# EAGLE design pcb (EAGLE 9.6.2)
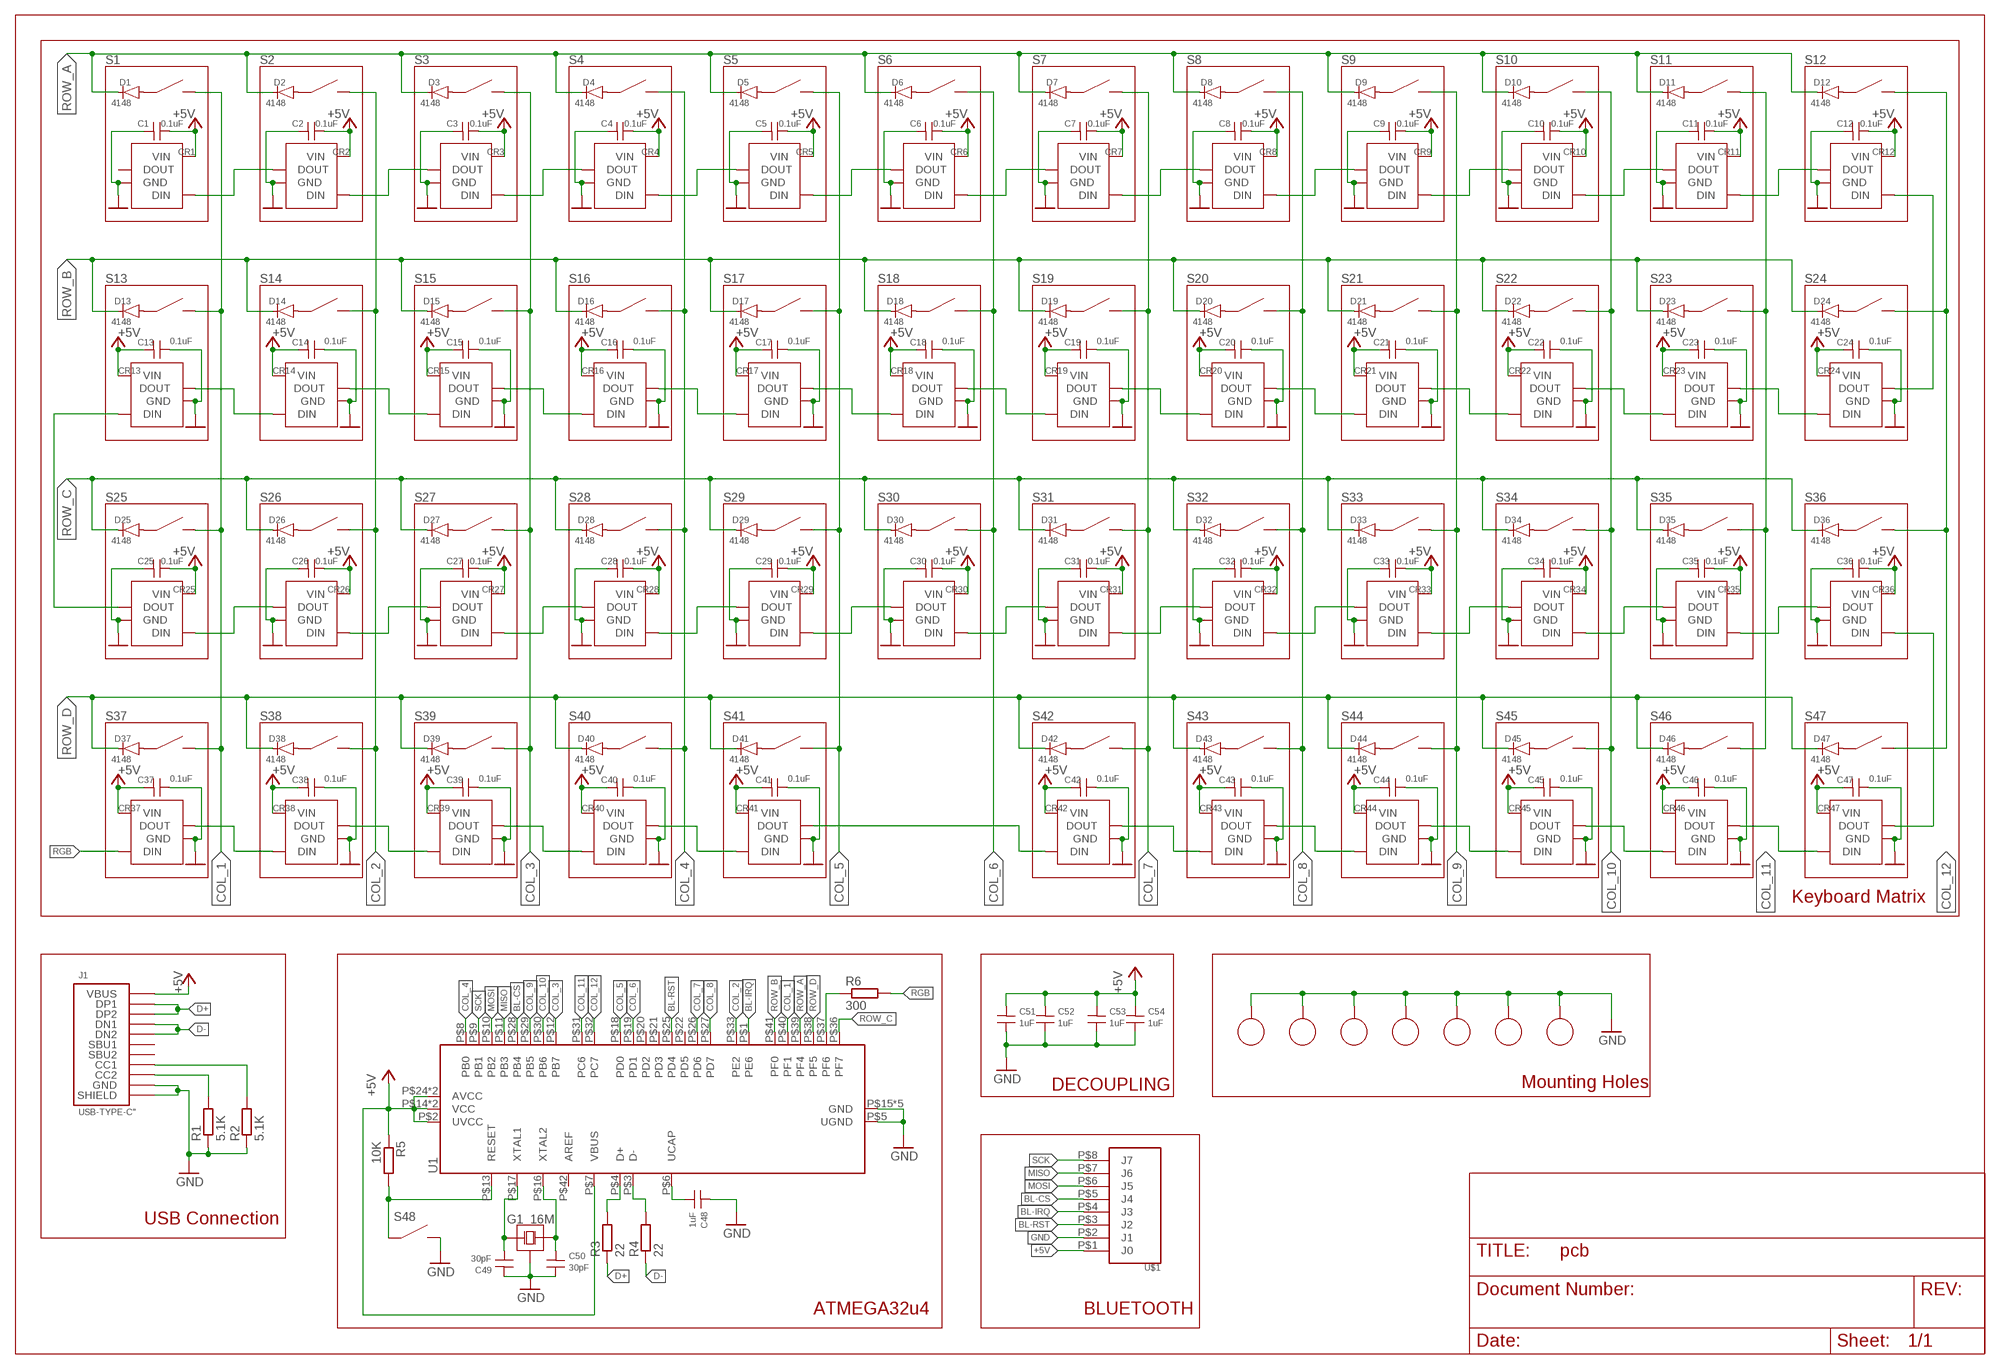
[diagram p0: schematic, sheet 1]

## Parts
C1  0.1uF  C-EU-0.1U-0402  [C0402]
C2  0.1uF  C-EU-0.1U-0402  [C0402]
C3  0.1uF  C-EU-0.1U-0402  [C0402]
C4  0.1uF  C-EU-0.1U-0402  [C0402]
C5  0.1uF  C-EU-0.1U-0402  [C0402]
C6  0.1uF  C-EU-0.1U-0402  [C0402]
C7  0.1uF  C-EU-0.1U-0402  [C0402]
C8  0.1uF  C-EU-0.1U-0402  [C0402]
C9  0.1uF  C-EU-0.1U-0402  [C0402]
C10  0.1uF  C-EU-0.1U-0402  [C0402]
C11  0.1uF  C-EU-0.1U-0402  [C0402]
C12  0.1uF  C-EU-0.1U-0402  [C0402]
C13  0.1uF  C-EU-0.1U-0402  [C0402]
C14  0.1uF  C-EU-0.1U-0402  [C0402]
C15  0.1uF  C-EU-0.1U-0402  [C0402]
C16  0.1uF  C-EU-0.1U-0402  [C0402]
C17  0.1uF  C-EU-0.1U-0402  [C0402]
C18  0.1uF  C-EU-0.1U-0402  [C0402]
C19  0.1uF  C-EU-0.1U-0402  [C0402]
C20  0.1uF  C-EU-0.1U-0402  [C0402]
C21  0.1uF  C-EU-0.1U-0402  [C0402]
C22  0.1uF  C-EU-0.1U-0402  [C0402]
C23  0.1uF  C-EU-0.1U-0402  [C0402]
C24  0.1uF  C-EU-0.1U-0402  [C0402]
C25  0.1uF  C-EU-0.1U-0402  [C0402]
C26  0.1uF  C-EU-0.1U-0402  [C0402]
C27  0.1uF  C-EU-0.1U-0402  [C0402]
C28  0.1uF  C-EU-0.1U-0402  [C0402]
C29  0.1uF  C-EU-0.1U-0402  [C0402]
C30  0.1uF  C-EU-0.1U-0402  [C0402]
C31  0.1uF  C-EU-0.1U-0402  [C0402]
C32  0.1uF  C-EU-0.1U-0402  [C0402]
C33  0.1uF  C-EU-0.1U-0402  [C0402]
C34  0.1uF  C-EU-0.1U-0402  [C0402]
C35  0.1uF  C-EU-0.1U-0402  [C0402]
C36  0.1uF  C-EU-0.1U-0402  [C0402]
C37  0.1uF  C-EU-0.1U-0402  [C0402]
C38  0.1uF  C-EU-0.1U-0402  [C0402]
C39  0.1uF  C-EU-0.1U-0402  [C0402]
C40  0.1uF  C-EU-0.1U-0402  [C0402]
C41  0.1uF  C-EU-0.1U-0402  [C0402]
C42  0.1uF  C-EU-0.1U-0402  [C0402]
C43  0.1uF  C-EU-0.1U-0402  [C0402]
C44  0.1uF  C-EU-0.1U-0402  [C0402]
C45  0.1uF  C-EU-0.1U-0402  [C0402]
C46  0.1uF  C-EU-0.1U-0402  [C0402]
C47  0.1uF  C-EU-0.1U-0402  [C0402]
C48  1uF  C-EU-1U-0402  [C0402]
C49  30pF  C-EU-30P-0402  [C0402]
C50  30pF  C-EU-30P-0402  [C0402]
C51  1uF  C-EU-1U-0402  [C0402]
C52  1uF  C-EU-1U-0402  [C0402]
C53  1uF  C-EU-1U-0402  [C0402]
C54  1uF  C-EU-1U-0402  [C0402]
CR1  SK6812MINI-E  [SK6812MINI-E]
CR2  SK6812MINI-E  [SK6812MINI-E]
CR3  SK6812MINI-E  [SK6812MINI-E]
CR4  SK6812MINI-E  [SK6812MINI-E]
CR5  SK6812MINI-E  [SK6812MINI-E]
CR6  SK6812MINI-E  [SK6812MINI-E]
CR7  SK6812MINI-E  [SK6812MINI-E]
CR8  SK6812MINI-E  [SK6812MINI-E]
CR9  SK6812MINI-E  [SK6812MINI-E]
CR10  SK6812MINI-E  [SK6812MINI-E]
CR11  SK6812MINI-E  [SK6812MINI-E]
CR12  SK6812MINI-E  [SK6812MINI-E]
CR13  SK6812MINI-E  [SK6812MINI-E]
CR14  SK6812MINI-E  [SK6812MINI-E]
CR15  SK6812MINI-E  [SK6812MINI-E]
CR16  SK6812MINI-E  [SK6812MINI-E]
CR17  SK6812MINI-E  [SK6812MINI-E]
CR18  SK6812MINI-E  [SK6812MINI-E]
CR19  SK6812MINI-E  [SK6812MINI-E]
CR20  SK6812MINI-E  [SK6812MINI-E]
CR21  SK6812MINI-E  [SK6812MINI-E]
CR22  SK6812MINI-E  [SK6812MINI-E]
CR23  SK6812MINI-E  [SK6812MINI-E]
CR24  SK6812MINI-E  [SK6812MINI-E]
CR25  SK6812MINI-E  [SK6812MINI-E]
CR26  SK6812MINI-E  [SK6812MINI-E]
CR27  SK6812MINI-E  [SK6812MINI-E]
CR28  SK6812MINI-E  [SK6812MINI-E]
CR29  SK6812MINI-E  [SK6812MINI-E]
CR30  SK6812MINI-E  [SK6812MINI-E]
CR31  SK6812MINI-E  [SK6812MINI-E]
CR32  SK6812MINI-E  [SK6812MINI-E]
CR33  SK6812MINI-E  [SK6812MINI-E]
CR34  SK6812MINI-E  [SK6812MINI-E]
CR35  SK6812MINI-E  [SK6812MINI-E]
CR36  SK6812MINI-E  [SK6812MINI-E]
CR37  SK6812MINI-E  [SK6812MINI-E]
CR38  SK6812MINI-E  [SK6812MINI-E]
CR39  SK6812MINI-E  [SK6812MINI-E]
CR40  SK6812MINI-E  [SK6812MINI-E]
CR41  SK6812MINI-E  [SK6812MINI-E]
CR42  SK6812MINI-E  [SK6812MINI-E]
CR43  SK6812MINI-E  [SK6812MINI-E]
CR44  SK6812MINI-E  [SK6812MINI-E]
CR45  SK6812MINI-E  [SK6812MINI-E]
CR46  SK6812MINI-E  [SK6812MINI-E]
CR47  SK6812MINI-E  [SK6812MINI-E]
D1  4148  DIODE-4148-MINI-MELF  [MINI_MELF]
D2  4148  DIODE-4148-MINI-MELF  [MINI_MELF]
D3  4148  DIODE-4148-MINI-MELF  [MINI_MELF]
D4  4148  DIODE-4148-MINI-MELF  [MINI_MELF]
D5  4148  DIODE-4148-MINI-MELF  [MINI_MELF]
D6  4148  DIODE-4148-MINI-MELF  [MINI_MELF]
D7  4148  DIODE-4148-MINI-MELF  [MINI_MELF]
D8  4148  DIODE-4148-MINI-MELF  [MINI_MELF]
D9  4148  DIODE-4148-MINI-MELF  [MINI_MELF]
D10  4148  DIODE-4148-MINI-MELF  [MINI_MELF]
D11  4148  DIODE-4148-MINI-MELF  [MINI_MELF]
D12  4148  DIODE-4148-MINI-MELF  [MINI_MELF]
D13  4148  DIODE-4148-MINI-MELF  [MINI_MELF]
D14  4148  DIODE-4148-MINI-MELF  [MINI_MELF]
D15  4148  DIODE-4148-MINI-MELF  [MINI_MELF]
D16  4148  DIODE-4148-MINI-MELF  [MINI_MELF]
D17  4148  DIODE-4148-MINI-MELF  [MINI_MELF]
D18  4148  DIODE-4148-MINI-MELF  [MINI_MELF]
D19  4148  DIODE-4148-MINI-MELF  [MINI_MELF]
D20  4148  DIODE-4148-MINI-MELF  [MINI_MELF]
D21  4148  DIODE-4148-MINI-MELF  [MINI_MELF]
D22  4148  DIODE-4148-MINI-MELF  [MINI_MELF]
D23  4148  DIODE-4148-MINI-MELF  [MINI_MELF]
D24  4148  DIODE-4148-MINI-MELF  [MINI_MELF]
D25  4148  DIODE-4148-MINI-MELF  [MINI_MELF]
D26  4148  DIODE-4148-MINI-MELF  [MINI_MELF]
D27  4148  DIODE-4148-MINI-MELF  [MINI_MELF]
D28  4148  DIODE-4148-MINI-MELF  [MINI_MELF]
D29  4148  DIODE-4148-MINI-MELF  [MINI_MELF]
D30  4148  DIODE-4148-MINI-MELF  [MINI_MELF]
D31  4148  DIODE-4148-MINI-MELF  [MINI_MELF]
D32  4148  DIODE-4148-MINI-MELF  [MINI_MELF]
D33  4148  DIODE-4148-MINI-MELF  [MINI_MELF]
D34  4148  DIODE-4148-MINI-MELF  [MINI_MELF]
D35  4148  DIODE-4148-MINI-MELF  [MINI_MELF]
D36  4148  DIODE-4148-MINI-MELF  [MINI_MELF]
D37  4148  DIODE-4148-MINI-MELF  [MINI_MELF]
D38  4148  DIODE-4148-MINI-MELF  [MINI_MELF]
D39  4148  DIODE-4148-MINI-MELF  [MINI_MELF]
D40  4148  DIODE-4148-MINI-MELF  [MINI_MELF]
D41  4148  DIODE-4148-MINI-MELF  [MINI_MELF]
D42  4148  DIODE-4148-MINI-MELF  [MINI_MELF]
D43  4148  DIODE-4148-MINI-MELF  [MINI_MELF]
D44  4148  DIODE-4148-MINI-MELF  [MINI_MELF]
D45  4148  DIODE-4148-MINI-MELF  [MINI_MELF]
D46  4148  DIODE-4148-MINI-MELF  [MINI_MELF]
D47  4148  DIODE-4148-MINI-MELF  [MINI_MELF]
G1  16M  CRYSTAL-PKG-16MSMD3225-4P  [SMD3225-4P]
J1  USB-TYPE-C"  [USB-C-SMD_TYPE-C16PIN]
R1  5.1K  R-EU-5.1K-0402  [R0402]
R2  5.1K  R-EU-5.1K-0402  [R0402]
R3  22  R-EU-22-0402  [R0402]
R4  22  R-EU-22-0402  [R0402]
R5  10K  R-EU-10K-0402  [R0402]
R6  300  R-EU-300-0402  [R0402]
S1  MX_SWITCH  [MX_SWITCH]
S2  MX_SWITCH  [MX_SWITCH]
S3  MX_SWITCH  [MX_SWITCH]
S4  MX_SWITCH  [MX_SWITCH]
S5  MX_SWITCH  [MX_SWITCH]
S6  MX_SWITCH  [MX_SWITCH]
S7  MX_SWITCH  [MX_SWITCH]
S8  MX_SWITCH  [MX_SWITCH]
S9  MX_SWITCH  [MX_SWITCH]
S10  MX_SWITCH  [MX_SWITCH]
S11  MX_SWITCH  [MX_SWITCH]
S12  MX_SWITCH  [MX_SWITCH]
S13  MX_SWITCH  [MX_SWITCH]
S14  MX_SWITCH  [MX_SWITCH]
S15  MX_SWITCH  [MX_SWITCH]
S16  MX_SWITCH  [MX_SWITCH]
S17  MX_SWITCH  [MX_SWITCH]
S18  MX_SWITCH  [MX_SWITCH]
S19  MX_SWITCH  [MX_SWITCH]
S20  MX_SWITCH  [MX_SWITCH]
S21  MX_SWITCH  [MX_SWITCH]
S22  MX_SWITCH  [MX_SWITCH]
S23  MX_SWITCH  [MX_SWITCH]
S24  MX_SWITCH  [MX_SWITCH]
S25  MX_SWITCH  [MX_SWITCH]
S26  MX_SWITCH  [MX_SWITCH]
S27  MX_SWITCH  [MX_SWITCH]
S28  MX_SWITCH  [MX_SWITCH]
S29  MX_SWITCH  [MX_SWITCH]
S30  MX_SWITCH  [MX_SWITCH]
S31  MX_SWITCH  [MX_SWITCH]
S32  MX_SWITCH  [MX_SWITCH]
S33  MX_SWITCH  [MX_SWITCH]
S34  MX_SWITCH  [MX_SWITCH]
S35  MX_SWITCH  [MX_SWITCH]
S36  MX_SWITCH  [MX_SWITCH]
S37  MX_SWITCH  [MX_SWITCH]
S38  MX_SWITCH  [MX_SWITCH]
S39  MX_SWITCH  [MX_SWITCH]
S40  MX_SWITCH  [MX_SWITCH]
S41  MX_SWITCH  [MX_SWITCH]
S42  MX_SWITCH  [MX_SWITCH]
S43  MX_SWITCH  [MX_SWITCH]
S44  MX_SWITCH  [MX_SWITCH]
S45  MX_SWITCH  [MX_SWITCH]
S46  MX_SWITCH  [MX_SWITCH]
S47  MX_SWITCH  [MX_SWITCH]
S48  SWITCH-SMD,3*4  [SMD,3X4X2.0MM]
U1  ATMEGA32U4-MUR  [QFN-44_7X7X05P]
U2  M2.5-HOLE  [M2.5]
U3  M2.5-HOLE  [M2.5]
U4  M2.5-HOLE  [M2.5]
U5  M2.5-HOLE  [M2.5]
U6  M2.5-HOLE  [M2.5]
U7  M2.5-HOLE  [M2.5]
U8  M2.5-HOLE  [M2.5]
U$1  JST-8PIN-SR  [JST-SR-8PIN]

## Nets
+5V: C1.P$2 C2.P$2 C3.P$2 C4.P$2 C5.P$2 C6.P$2 C7.P$2 C8.P$2 C9.P$2 C10.P$2 C11.P$2 C12.P$2 C13.P$1 C14.P$1 C15.P$1 C16.P$1 C17.P$1 C18.P$1 C19.P$1 C20.P$1 C21.P$1 C22.P$1 C23.P$1 C24.P$1 C25.P$2 C26.P$2 C27.P$2 C28.P$2 C29.P$2 C30.P$2 C31.P$2 C32.P$2 C33.P$2 C34.P$2 C35.P$2 C36.P$2 C37.P$1 C38.P$1 C39.P$1 C40.P$1 C41.P$1 C42.P$1 C43.P$1 C44.P$1 C45.P$1 C46.P$1 C47.P$1 C51.P$1 C52.P$1 C53.P$1 C54.P$1 CR1.P$1(VIN) CR2.P$1(VIN) CR3.P$1(VIN) CR4.P$1(VIN) CR5.P$1(VIN) CR6.P$1(VIN) CR7.P$1(VIN) CR8.P$1(VIN) CR9.P$1(VIN) CR10.P$1(VIN) CR11.P$1(VIN) CR12.P$1(VIN) CR13.P$1(VIN) CR14.P$1(VIN) CR15.P$1(VIN) CR16.P$1(VIN) CR17.P$1(VIN) CR18.P$1(VIN) CR19.P$1(VIN) CR20.P$1(VIN) CR21.P$1(VIN) CR22.P$1(VIN) CR23.P$1(VIN) CR24.P$1(VIN) CR25.P$1(VIN) CR26.P$1(VIN) CR27.P$1(VIN) CR28.P$1(VIN) CR29.P$1(VIN) CR30.P$1(VIN) CR31.P$1(VIN) CR32.P$1(VIN) CR33.P$1(VIN) CR34.P$1(VIN) CR35.P$1(VIN) CR36.P$1(VIN) CR37.P$1(VIN) CR38.P$1(VIN) CR39.P$1(VIN) CR40.P$1(VIN) CR41.P$1(VIN) CR42.P$1(VIN) CR43.P$1(VIN) CR44.P$1(VIN) CR45.P$1(VIN) CR46.P$1(VIN) CR47.P$1(VIN) J1.A4B9(VBUS) J1.B4A9(VBUS) R5.P$1 U1.P$2(UVCC) U1.P$7(VBUS) U1.P$14(VCC) U1.P$24(AVCC) U1.P$34(VCC) U1.P$44(AVCC) U$1.P$1(J0)
BL-CS: U1.P$28(PB4) U$1.P$5(J4)
BL-IRQ: U1.P$1(PE6) U$1.P$4(J3)
BL-RST: U1.P$25(PD4) U$1.P$3(J2)
COL_1: S1.P$2 S13.P$2 S25.P$2 S37.P$2 U1.P$40(PF1)
COL_2: S2.P$2 S14.P$2 S26.P$2 S38.P$2 U1.P$33(PE2)
COL_3: S3.P$2 S15.P$2 S27.P$2 S39.P$2 U1.P$12(PB7)
COL_4: S4.P$2 S16.P$2 S28.P$2 S40.P$2 U1.P$8(PB0)
COL_5: S5.P$2 S17.P$2 S29.P$2 S41.P$2 U1.P$18(PD0)
COL_6: S6.P$2 S18.P$2 S30.P$2 U1.P$19(PD1)
COL_7: S7.P$2 S19.P$2 S31.P$2 S42.P$2 U1.P$26(PD6)
COL_8: S8.P$2 S20.P$2 S32.P$2 S43.P$2 U1.P$27(PD7)
COL_9: S9.P$2 S21.P$2 S33.P$2 S44.P$2 U1.P$29(PB5)
COL_10: S10.P$2 S22.P$2 S34.P$2 S45.P$2 U1.P$30(PB6)
COL_11: S11.P$2 S23.P$2 S35.P$2 S46.P$2 U1.P$31(PC6)
COL_12: S12.P$2 S24.P$2 S36.P$2 S47.P$2 U1.P$32(PC7)
D+: J1.A6(DP1) J1.B6(DP2) R3.P$1
D-: J1.A7(DN1) J1.B7(DN2) R4.P$1
GND: C1.P$1 C2.P$1 C3.P$1 C4.P$1 C5.P$1 C6.P$1 C7.P$1 C8.P$1 C9.P$1 C10.P$1 C11.P$1 C12.P$1 C13.P$2 C14.P$2 C15.P$2 C16.P$2 C17.P$2 C18.P$2 C19.P$2 C20.P$2 C21.P$2 C22.P$2 C23.P$2 C24.P$2 C25.P$1 C26.P$1 C27.P$1 C28.P$1 C29.P$1 C30.P$1 C31.P$1 C32.P$1 C33.P$1 C34.P$1 C35.P$1 C36.P$1 C37.P$2 C38.P$2 C39.P$2 C40.P$2 C41.P$2 C42.P$2 C43.P$2 C44.P$2 C45.P$2 C46.P$2 C47.P$2 C48.P$1 C49.P$1 C50.P$2 C51.P$2 C52.P$2 C53.P$2 C54.P$2 CR1.P$4(GND) CR2.P$4(GND) CR3.P$4(GND) CR4.P$4(GND) CR5.P$4(GND) CR6.P$4(GND) CR7.P$4(GND) CR8.P$4(GND) CR9.P$4(GND) CR10.P$4(GND) CR11.P$4(GND) CR12.P$4(GND) CR13.P$4(GND) CR14.P$4(GND) CR15.P$4(GND) CR16.P$4(GND) CR17.P$4(GND) CR18.P$4(GND) CR19.P$4(GND) CR20.P$4(GND) CR21.P$4(GND) CR22.P$4(GND) CR23.P$4(GND) CR24.P$4(GND) CR25.P$4(GND) CR26.P$4(GND) CR27.P$4(GND) CR28.P$4(GND) CR29.P$4(GND) CR30.P$4(GND) CR31.P$4(GND) CR32.P$4(GND) CR33.P$4(GND) CR34.P$4(GND) CR35.P$4(GND) CR36.P$4(GND) CR37.P$4(GND) CR38.P$4(GND) CR39.P$4(GND) CR40.P$4(GND) CR41.P$4(GND) CR42.P$4(GND) CR43.P$4(GND) CR44.P$4(GND) CR45.P$4(GND) CR46.P$4(GND) CR47.P$4(GND) G1.P$2(P2) G1.P$4(P2) J1.A1B12(GND) J1.B1A12(GND) J1.SHIELD J1.SHIELD1(SHIELD) J1.SHIELD2(SHIELD) J1.SHIELD3(SHIELD) R1.P$1 R2.P$1 S48.P$2 U1.P$5(UGND) U1.P$15(GND) U1.P$23(GND) U1.P$35(GND) U1.P$43(GND) U1.P$45(GND) U2.P$1(P1) U3.P$1(P1) U4.P$1(P1) U5.P$1(P1) U6.P$1(P1) U7.P$1(P1) U8.P$1(P1) U$1.P$2(J1)
MISO: U1.P$11(PB3) U$1.P$7(J6)
MOSI: U1.P$10(PB2) U$1.P$6(J5)
N$1: CR12.P$3(DIN) CR24.P$2(DOUT)
N$2: CR13.P$3(DIN) CR25.P$2(DOUT)
N$3: R3.P$2 U1.P$4(D+)
N$4: J1.B5(CC2) R1.P$2
N$5: D1.P$2(+) S1.P$1
N$6: J1.A5(CC1) R2.P$2
N$7: R4.P$2 U1.P$3(D-)
N$8: R5.P$2 S48.P$1 U1.P$13(RESET)
N$9: CR1.P$3(DIN) CR2.P$2(DOUT)
N$10: D2.P$2(+) S2.P$1
N$11: C48.P$2 U1.P$6(UCAP)
N$12: C49.P$2 G1.P$1(P0) U1.P$17(XTAL1)
N$13: CR2.P$3(DIN) CR3.P$2(DOUT)
N$14: D13.P$2(+) S13.P$1
N$16: R6.P$1 U1.P$37(PF6)
N$17: CR13.P$2(DOUT) CR14.P$3(DIN)
N$18: C50.P$1 G1.P$3(P1) U1.P$16(XTAL2)
N$19: D20.P$2(+) S20.P$1
N$20: D3.P$2(+) S3.P$1
N$23: CR3.P$3(DIN) CR4.P$2(DOUT)
N$27: CR19.P$2(DOUT) CR20.P$3(DIN)
N$28: D14.P$2(+) S14.P$1
N$30: D4.P$2(+) S4.P$1
N$33: CR4.P$3(DIN) CR5.P$2(DOUT)
N$35: CR14.P$2(DOUT) CR15.P$3(DIN)
N$40: D5.P$2(+) S5.P$1
N$43: CR5.P$3(DIN) CR6.P$2(DOUT)
N$46: D15.P$2(+) S15.P$1
N$49: CR15.P$2(DOUT) CR16.P$3(DIN)
N$50: D6.P$2(+) S6.P$1
N$53: CR6.P$3(DIN) CR7.P$2(DOUT)
N$55: D21.P$2(+) S21.P$1
N$59: CR20.P$2(DOUT) CR21.P$3(DIN)
N$60: D7.P$2(+) S7.P$1
N$63: CR7.P$3(DIN) CR8.P$2(DOUT)
N$64: D16.P$2(+) S16.P$1
N$65: CR27.P$3(DIN) CR28.P$2(DOUT)
N$67: CR16.P$2(DOUT) CR17.P$3(DIN)
N$70: D8.P$2(+) S8.P$1
N$73: CR8.P$3(DIN) CR9.P$2(DOUT)
N$78: D17.P$2(+) S17.P$1
N$80: D9.P$2(+) S9.P$1
N$83: CR9.P$3(DIN) CR10.P$2(DOUT)
N$85: CR17.P$2(DOUT) CR18.P$3(DIN)
N$87: D22.P$2(+) S22.P$1
N$90: D10.P$2(+) S10.P$1
N$93: CR10.P$3(DIN) CR11.P$2(DOUT)
N$95: CR21.P$2(DOUT) CR22.P$3(DIN)
N$96: D18.P$2(+) S18.P$1
N$100: D11.P$2(+) S11.P$1
N$103: CR11.P$3(DIN) CR12.P$2(DOUT)
N$110: D12.P$2(+) S12.P$1
N$114: D19.P$2(+) S19.P$1
N$118: CR18.P$2(DOUT) CR19.P$3(DIN)
N$119: D23.P$2(+) S23.P$1
N$123: CR22.P$2(DOUT) CR23.P$3(DIN)
N$129: D24.P$2(+) S24.P$1
N$133: CR23.P$2(DOUT) CR24.P$3(DIN)
N$139: D25.P$2(+) S25.P$1
N$142: CR25.P$3(DIN) CR26.P$2(DOUT)
N$149: D26.P$2(+) S26.P$1
N$152: CR26.P$3(DIN) CR27.P$2(DOUT)
N$159: D27.P$2(+) S27.P$1
N$169: D28.P$2(+) S28.P$1
N$172: CR28.P$3(DIN) CR29.P$2(DOUT)
N$179: D29.P$2(+) S29.P$1
N$182: CR29.P$3(DIN) CR30.P$2(DOUT)
N$189: D30.P$2(+) S30.P$1
N$192: CR30.P$3(DIN) CR31.P$2(DOUT)
N$199: D31.P$2(+) S31.P$1
N$202: CR31.P$3(DIN) CR32.P$2(DOUT)
N$209: D32.P$2(+) S32.P$1
N$212: CR32.P$3(DIN) CR33.P$2(DOUT)
N$219: D33.P$2(+) S33.P$1
N$222: CR33.P$3(DIN) CR34.P$2(DOUT)
N$229: D34.P$2(+) S34.P$1
N$232: CR34.P$3(DIN) CR35.P$2(DOUT)
N$239: D35.P$2(+) S35.P$1
N$242: CR35.P$3(DIN) CR36.P$2(DOUT)
N$249: D36.P$2(+) S36.P$1
N$252: CR36.P$3(DIN) CR47.P$2(DOUT)
N$259: D37.P$2(+) S37.P$1
N$269: D38.P$2(+) S38.P$1
N$273: CR37.P$2(DOUT) CR38.P$3(DIN)
N$279: D39.P$2(+) S39.P$1
N$283: CR38.P$2(DOUT) CR39.P$3(DIN)
N$289: D40.P$2(+) S40.P$1
N$293: CR39.P$2(DOUT) CR40.P$3(DIN)
N$299: D41.P$2(+) S41.P$1
N$303: CR40.P$2(DOUT) CR41.P$3(DIN)
N$309: D42.P$2(+) S42.P$1
N$313: CR41.P$2(DOUT) CR42.P$3(DIN)
N$319: D43.P$2(+) S43.P$1
N$323: CR42.P$2(DOUT) CR43.P$3(DIN)
N$329: D44.P$2(+) S44.P$1
N$333: CR43.P$2(DOUT) CR44.P$3(DIN)
N$339: D45.P$2(+) S45.P$1
N$343: CR44.P$2(DOUT) CR45.P$3(DIN)
N$349: D46.P$2(+) S46.P$1
N$353: CR45.P$2(DOUT) CR46.P$3(DIN)
N$359: D47.P$2(+) S47.P$1
N$363: CR46.P$2(DOUT) CR47.P$3(DIN)
RGB: CR37.P$3(DIN) R6.P$2
ROW_A: D1.P$1(-) D2.P$1(-) D3.P$1(-) D4.P$1(-) D5.P$1(-) D6.P$1(-) D7.P$1(-) D8.P$1(-) D9.P$1(-) D10.P$1(-) D11.P$1(-) D12.P$1(-) U1.P$39(PF4)
ROW_B: D13.P$1(-) D14.P$1(-) D15.P$1(-) D16.P$1(-) D17.P$1(-) D18.P$1(-) D19.P$1(-) D20.P$1(-) D21.P$1(-) D22.P$1(-) D23.P$1(-) D24.P$1(-) U1.P$41(PF0)
ROW_C: D25.P$1(-) D26.P$1(-) D27.P$1(-) D28.P$1(-) D29.P$1(-) D30.P$1(-) D31.P$1(-) D32.P$1(-) D33.P$1(-) D34.P$1(-) D35.P$1(-) D36.P$1(-) U1.P$36(PF7)
ROW_D: D37.P$1(-) D38.P$1(-) D39.P$1(-) D40.P$1(-) D41.P$1(-) D42.P$1(-) D43.P$1(-) D44.P$1(-) D45.P$1(-) D46.P$1(-) D47.P$1(-) U1.P$38(PF5)
SCK: U1.P$9(PB1) U$1.P$8(J7)
Unconnected: CR1.P$2(DOUT) J1.A8(SBU1) J1.B8(SBU2) U1.P$20(PD2) U1.P$21(PD3) U1.P$22(PD5) U1.P$42(AREF)

## Notes on the sheet
- Keyboard Matrix
- DECOUPLING | Mounting Holes
- USB Connection
- ATMEGA32u4 | BLUETOOTH

## Library data of the parts
C1-C47 = tow:C-EU: Multilayer Ceramic Capacitors MLCC - SMD/SMT RoHS; DESC: 0402 Multilayer Ceramic Capacitors MLCC - SMD/SMT ROHS; LCSC-PART: C392963; MANUFACTURER: CCTC; MFGPART#: TCC0402X7R104K160AT; PACKAGE: 0402; TYPE: SMD
C48 C51-C54 = tow:C-EU: Multilayer Ceramic Capacitors MLCC - SMD/SMT RoHS; DESC: 0402 Multilayer Ceramic Capacitors MLCC - SMD/SMT ROHS; LCSC-PART: C107372; MANUFACTURER: Samsung Electro-Mechanics; MFGPART#: CL05A105KQ5NNNC; PACKAGE: 0402; TYPE: SMD
C49 C50 = tow:C-EU: Multilayer Ceramic Capacitors MLCC - SMD/SMT RoHS; DESC: 0402 Multilayer Ceramic Capacitors MLCC - SMD/SMT ROHS; LCSC-PART: C107004; MANUFACTURER: YAGEO; MFGPART#: CC0402JRNPO9BN300; PACKAGE: 0402; TYPE: SMD
CR1-CR47 = tow:SK6812MINI-E; SPICEPREFIX: E
D1-D47 = tow:DIODE; DESC: MINI-MELF Switching Diode ROHS; LCSC-PART: C402260; MANUFACTURER: LGE; MFGPART#: LL4148; PACKAGE: MINI-MELF; SPICEPREFIX: D; TYPE: SMD
G1 = tow:CRYSTAL-PKG; DESC: SMD3225-4P Crystals ROHS; LCSC-PART: C12668; MANUFACTURER: Yangxing Tech; MFGPART#: X322516MOB4SI; PACKAGE: SMD3225-4P; TYPE: SMD
J1 = tow:USB-TYPE-C: SMD USB Connectors RoHS; LCSC-PART: C393939; MANUFACTURER: SHOU HAN; MFGPART#: TYPE-C16PIN; PACKAGE: SMD; TYPE: SMD
R1 R2 = tow:R-EU: Chip Resistor - Surface Mount RoHS; DESC: 0402 Chip Resistor - Surface Mount ROHS; LCSC-PART: C325521; MANUFACTURER: TyoHM; MFGPART#: RMC04025.1K1%N; PACKAGE: 0402; TYPE: SMD
R3 R4 = tow:R-EU: Chip Resistor - Surface Mount RoHS; DESC: 22Ω ±1% 1/16W ±100ppm/℃ 0402; LCSC-PART: C163821; MANUFACTURER: Walsin Tech Corp; MFGPART#: WR04X22R0FTL; PACKAGE: 0402; TYPE: SMD
R5 = tow:R-EU: Chip Resistor - Surface Mount RoHS; DESC: 10kΩ ±5% 1/16W ±200ppm/℃ 0402; LCSC-PART: C140214; MANUFACTURER: FH(Guangdong Fenghua Advanced Tech); MFGPART#: RC-02W103JT; PACKAGE: 0402; TYPE: SMD
R6 = tow:R-EU: Chip Resistor - Surface Mount RoHS; DESC: 0.0625W ±1% 300Ω ±100ppm/℃ 0402 Chip Resistor - Surface Mount ROHS; LCSC-PART: C911734; MANUFACTURER: TA-I Tech; MFGPART#: RMS04FT3000; PACKAGE: 0402; TYPE: SMD
S1-S47 = tow:MX_SWITCH: Cherry Mx Switch; SPICEPREFIX: B
S48 = tow:SWITCH: SMD Tactile Switches RoHS; DESC: Top Actuated 50mA @ 12VDC Round Button 260gf SPST SMD,3x4x2.0mm Tactile Switches ROHS; LCSC-PART: C455280; MANUFACTURER: XUNPU; MFGPART#: TS-1088R-02026; PACKAGE: SMD,3*4; TYPE: SMD
U1 = tow:ATMEGA32U4; DESC: 2.7V ~ 5.5V 8-Bit AVR 16MHz FLASH 26 QFN-44_7x7x05P ATMEL & AVR ROHS; LCSC-PART: C45874; MANUFACTURER: Microchip Tech; MFGPART#: ATMEGA32U4-MUR; PACKAGE: QFN-44_7x7x05P; TYPE: SMD
U2-U8 = mounting-holes:M2.5-HOLE
U$1 = tow:JST-8PIN; DESC: 8 Header SR/SZ 0.039"(1.00mm) Male Pin - Wire To Board / Wire To Wire Connector ROHS; LCSC-PART: C160407; MANUFACTURER: JST Sales America; MFGPART#: SM08B-SRSS-TB(LF)(SN); PACKAGE: -; TYPE: SMD

## Board
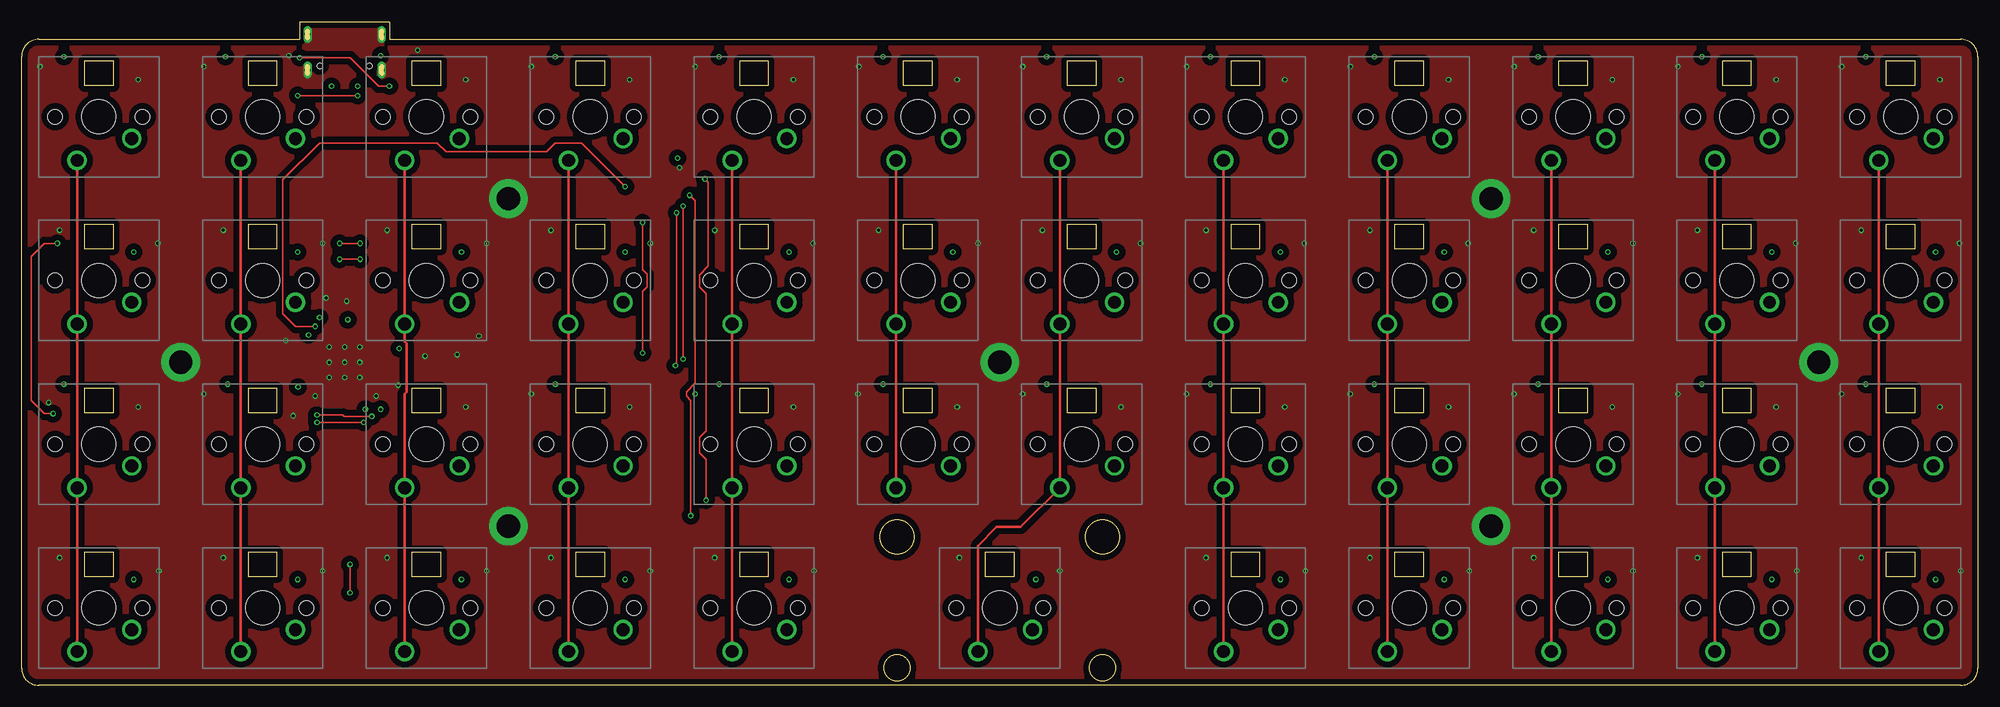
[diagram p1: board, top side]
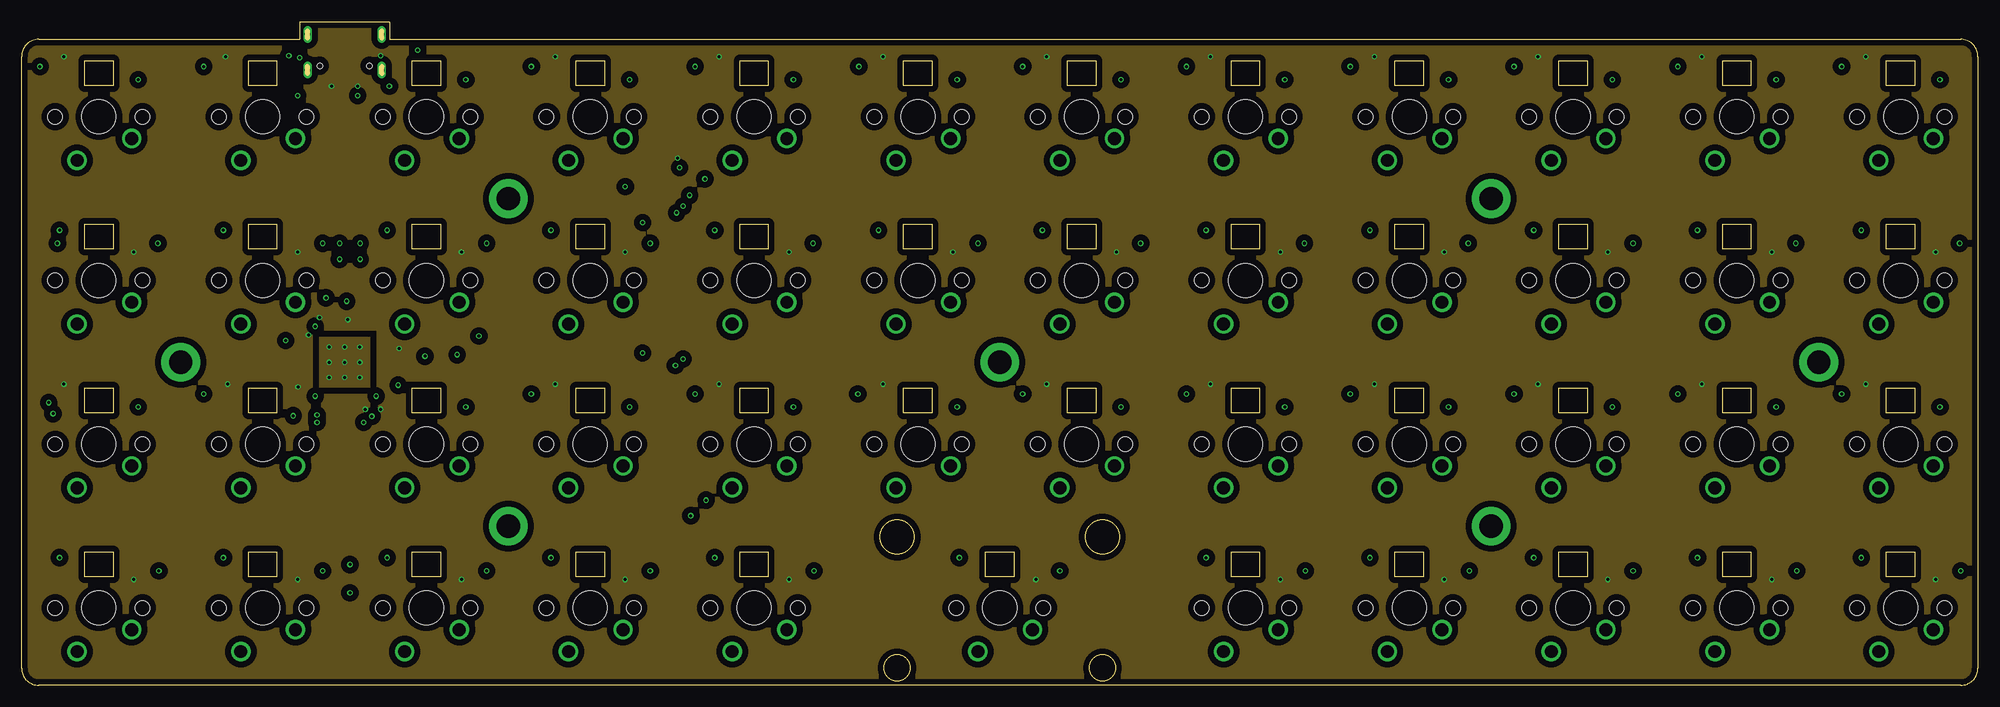
[diagram p2: board, inner layer Route2]
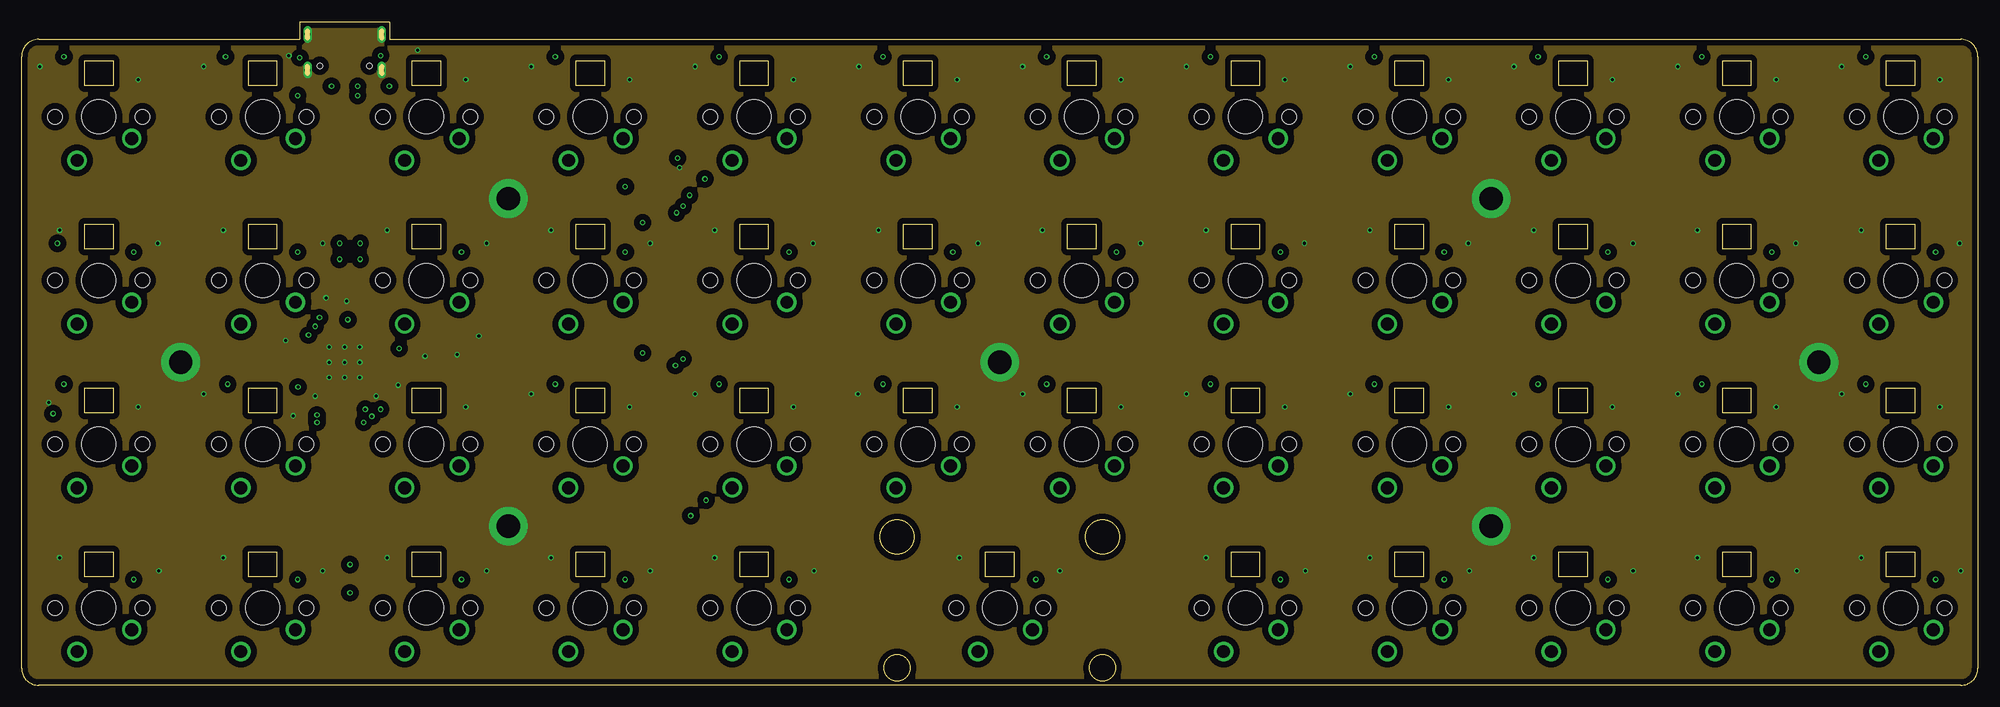
[diagram p3: board, inner layer Route15]
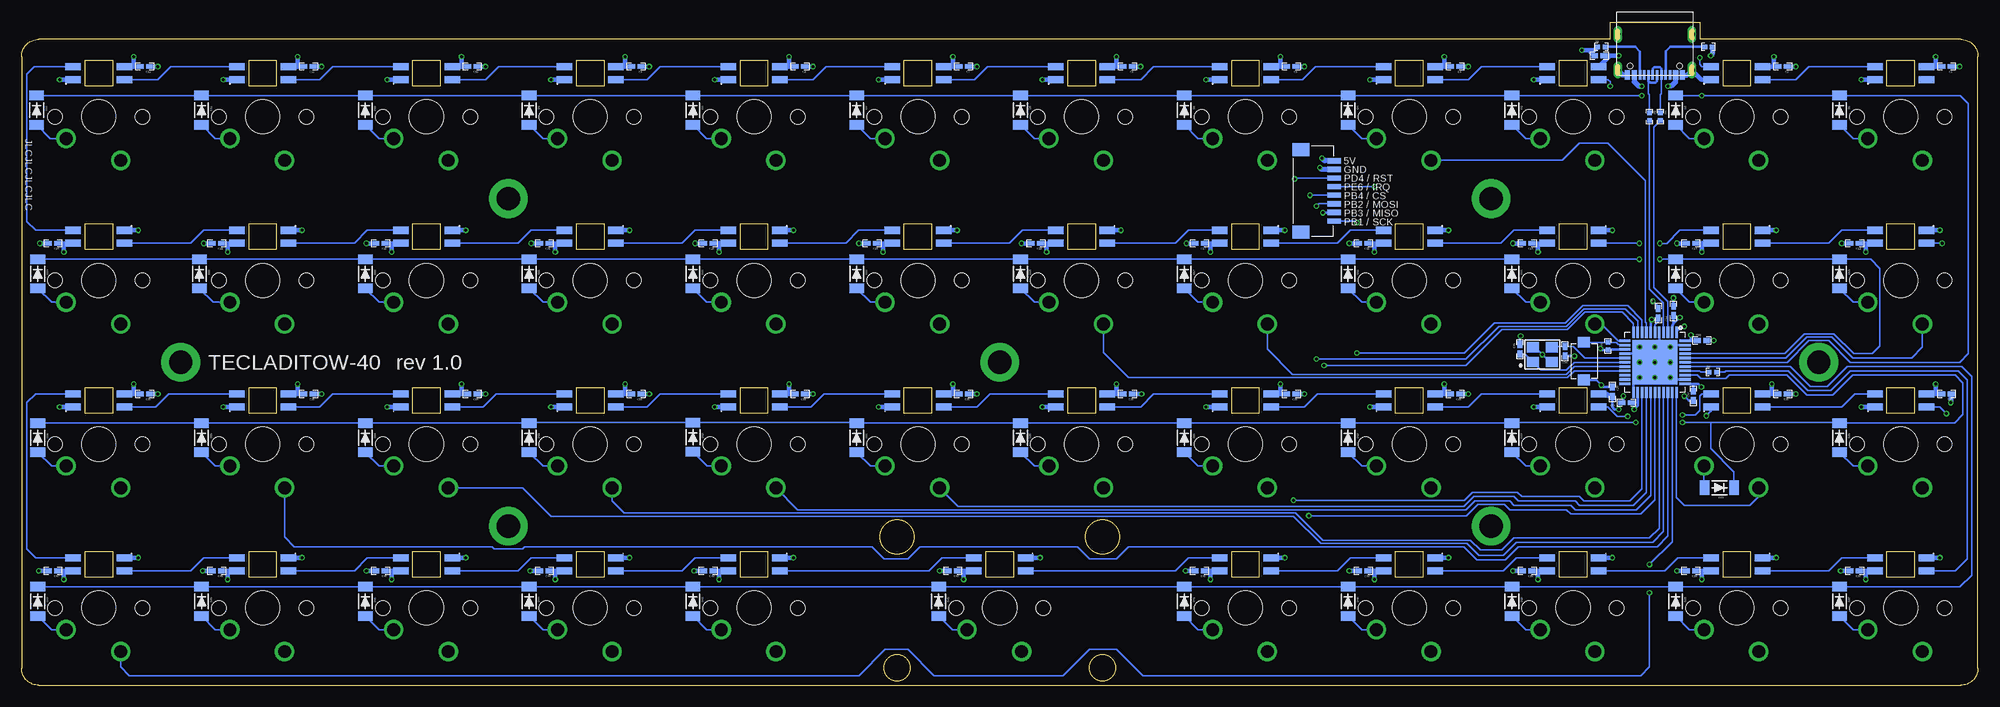
[diagram p4: board, bottom side, seen from below]

Size 227.55 x 77.15 mm. Coordinates in mm from the lower left corner, seen from the top.
Outline: 2,75.15 arc90 0,73.15 0,2 arc90 2,0 225.55,0 arc90 227.55,2 227.55,73.15 arc90 225.55,75.15 42.83,75.15 42.83,77.15 32.33,77.15 32.33,75.15 2,75.15
Outline: circle at 101.84,17.25 radius 2
Outline: circle at 101.84,2.01 radius 1.52
Outline: circle at 125.71,2.01 radius 1.52
Outline: circle at 125.71,17.25 radius 2
Copper layers (1+2*15+16): Top 0.035mm / dielectric 0.2mm / Route2 0.0175mm / dielectric 1.065mm / Route15 0.0175mm / dielectric 0.2mm / Bottom 0.035mm
Design rules "default *": minimum track width 5mil, minimum drill 0.2mm, track to track 5mil, track to pad 0.2mm, pad to pad 5mil, via to via 10mil, smd to smd 5mil, copper to edge 10mil, drill to drill 0.5mm, minimum pad ring 0.13mm, minimum via ring 0.13mm, stop-mask expansion 4mil, vias tented up to drill 0mil, thermal gap 40mil

### Footprints (pad centres in the part's own frame; a part is rotated, then mirrored left to right if it is on the bottom)
C0402 = smd 0.8 x 0.55: P$1 -0.545,0; P$2 0.545,0
SK6812MINI-E = smd 1.8 x 0.82 bottom: P$1 -3,0.75; P$2 -3,-0.75; P$3 3,0.75; P$4 3,-0.75
MINI_MELF = smd 1.1 x 1.7: P$1 -1.7,0; P$2 1.7,0
SMD3225-4P = smd 1.4 x 1.2: P$1 -1.1,-0.85; P$2 1.1,-0.85; P$3 1.1,0.85; P$4 -1.1,0.85
USB-C-SMD_TYPE-C16PIN = smd 0.6 x 1.15: A1B12 -3.2,2.362; A4B9 -2.4,2.362; B1A12 3.2,2.362; B4A9 2.4,2.362 | smd 0.3 x 1.15: A5 -1.25,2.362; A6 -0.25,2.362; A7 0.25,2.362; A8 -1.75,2.362; B5 1.75,2.362; B6 0.75,2.362; B7 -0.75,2.362; B8 1.25,2.362 | drill 0.6 pad 1 long: SHIELD -4.32,1.787; SHIELD1 4.32,1.787; SHIELD2 -4.32,-2.363; SHIELD3 4.32,-2.363 | hole 0.65: -2.89,1.288; 2.89,1.288
R0402 = smd 0.55 x 0.55: P$1 -0.433,0; P$2 0.433,0
MX_SWITCH = drill 1.499: P$1 -3.81,2.54; P$2 2.54,5.08 | hole 3.988: 0,0 | hole 1.702: -5.08,0; 5.08,0
SMD,3X4X2.0MM = smd 1.23 x 1.36: P$1 -2.185,0; P$2 2.185,0
QFN-44_7X7X05P = smd 0.3 x 1.3: P$1 -2.5,-3.5; P$2 -2,-3.5; P$3 -1.5,-3.5; P$4 -1,-3.5; P$5 -0.5,-3.5; P$6 0,-3.5; P$7 0.5,-3.5; P$8 1,-3.5; P$9 1.5,-3.5; P$10 2,-3.5; P$11 2.5,-3.5; P$23 2.5,3.5; P$24 2,3.5; P$25 1.5,3.5; P$26 1,3.5; P$27 0.5,3.5; P$28 0,3.5; P$29 -0.5,3.5; P$30 -1,3.5; P$31 -1.5,3.5; P$32 -2,3.5; P$33 -2.5,3.5 | smd 1.3 x 0.3: P$12 3.5,-2.5; P$13 3.5,-2; P$14 3.5,-1.5; P$15 3.5,-1; P$16 3.5,-0.5; P$17 3.5,0; P$18 3.5,0.5; P$19 3.5,1; P$20 3.5,1.5; P$21 3.5,2; P$22 3.5,2.5; P$34 -3.5,2.5; P$35 -3.5,2; P$36 -3.5,1.5; P$37 -3.5,1; P$38 -3.5,0.5; P$39 -3.5,0; P$40 -3.5,-0.5; P$41 -3.5,-1; P$42 -3.5,-1.5; P$43 -3.5,-2; P$44 -3.5,-2.5 | smd 5.2 x 5.2: P$45 0,0
M2.5 = drill 2.7 pad 4.5: P$1 0,0
JST-SR-8PIN = smd 0.6 x 1.55: P$1 -3.5,1.937; P$2 -2.5,1.937; P$3 -1.5,1.937; P$4 -0.5,1.937; P$5 0.5,1.937; P$6 1.5,1.937; P$7 2.5,1.937; P$8 3.5,1.937 | smd 1.5 x 2: P$9 4.8,-1.938; P$10 -4.8,-1.938

### Placement (x,y rotation side)
C1  3.67,71.99 180 bottom
C2  22.72,71.99 180 bottom
C3  44.05,73.26 0 bottom
C4  60.82,71.99 180 bottom
C5  79.87,71.99 180 bottom
C6  98.92,71.99 180 bottom
C7  117.97,71.99 180 bottom
C8  137.02,71.99 180 bottom
C9  156.07,71.99 180 bottom
C10  175.12,71.99 180 bottom
C11  194.17,71.99 180 bottom
C12  213.22,71.99 180 bottom
C13  14.33,51.42 180 bottom
C14  33.38,51.42 180 bottom
C15  52.43,51.42 180 bottom
C16  71.48,51.42 180 bottom
C17  90.53,51.42 180 bottom
C18  109.58,51.42 180 bottom
C19  128.63,51.42 180 bottom
C20  147.68,51.42 180 bottom
C21  166.73,51.42 180 bottom
C22  185.78,51.42 180 bottom
C23  204.83,51.42 180 bottom
C24  223.88,51.42 180 bottom
C25  3.67,33.89 180 bottom
C26  22.72,33.89 180 bottom
C27  42.53,34.15 270 bottom
C28  60.82,33.89 180 bottom
C29  79.87,33.89 180 bottom
C30  98.92,33.89 180 bottom
C31  117.97,33.89 180 bottom
C32  137.02,33.89 180 bottom
C33  156.07,33.89 180 bottom
C34  175.12,33.89 180 bottom
C35  194.17,33.89 180 bottom
C36  213.22,33.89 180 bottom
C37  14.33,13.31 180 bottom
C38  33.38,13.31 180 bottom
C39  52.43,13.31 180 bottom
C40  71.48,13.31 180 bottom
C41  90.53,13.31 180 bottom
C42  119.24,13.32 180 bottom
C43  147.68,13.32 180 bottom
C44  166.73,13.32 180 bottom
C45  185.78,13.32 180 bottom
C46  204.83,13.32 180 bottom
C47  223.88,13.32 180 bottom
C48  37.19,43.29 270 bottom
C49  53.29,39.09 270 bottom
C50  48.04,38.86 270 bottom
C51  40.88,32.88 180 bottom
C52  33.12,33.67 270 bottom
C53  32.11,40.11 0 bottom
C54  35.42,43.54 90 bottom
CR1  9,71.23 0 top
CR2  28.05,71.23 0 top
CR3  47.1,71.23 0 top
CR4  66.15,71.23 0 top
CR5  85.2,71.23 0 top
CR6  104.25,71.23 0 top
CR7  123.3,71.23 0 top
CR8  142.35,71.23 0 top
CR9  161.4,71.23 0 top
CR10  180.45,71.23 0 top
CR11  199.5,71.23 0 top
CR12  218.55,71.23 0 top
CR13  9,52.18 180 top
CR14  28.05,52.18 180 top
CR15  47.1,52.18 180 top
CR16  66.15,52.18 180 top
CR17  85.2,52.18 180 top
CR18  104.25,52.18 180 top
CR19  123.3,52.18 180 top
CR20  142.35,52.18 180 top
CR21  161.4,52.18 180 top
CR22  180.45,52.18 180 top
CR23  199.5,52.18 180 top
CR24  218.55,52.18 180 top
CR25  9,33.13 0 top
CR26  28.05,33.13 0 top
CR27  47.1,33.13 0 top
CR28  66.15,33.13 0 top
CR29  85.2,33.13 0 top
CR30  104.25,33.13 0 top
CR31  123.3,33.13 0 top
CR32  142.35,33.13 0 top
CR33  161.4,33.13 0 top
CR34  180.45,33.13 0 top
CR35  199.5,33.13 0 top
CR36  218.55,33.13 0 top
CR37  9,14.08 180 top
CR38  28.05,14.08 180 top
CR39  47.1,14.08 180 top
CR40  66.15,14.08 180 top
CR41  85.2,14.08 180 top
CR42  113.78,14.08 180 top
CR43  142.35,14.08 180 top
CR44  161.4,14.08 180 top
CR45  180.45,14.08 180 top
CR46  199.5,14.08 180 top
CR47  218.55,14.08 180 top
D1  16.11,66.91 270 bottom
D2  35.16,66.91 270 bottom
D3  54.21,66.91 270 bottom
D4  73.26,66.91 270 bottom
D5  92.31,66.91 270 bottom
D6  111.36,66.91 270 bottom
D7  130.41,66.91 270 bottom
D8  149.46,66.91 270 bottom
D9  168.51,66.91 270 bottom
D10  187.56,66.91 270 bottom
D11  206.61,66.91 270 bottom
D12  225.79,66.91 270 bottom
D13  16.11,47.86 270 bottom
D14  35.16,47.86 270 bottom
D15  54.21,47.86 270 bottom
D16  73.26,47.86 270 bottom
D17  92.31,47.86 270 bottom
D18  111.36,47.86 270 bottom
D19  130.41,47.86 270 bottom
D20  149.46,47.86 270 bottom
D21  168.51,47.86 270 bottom
D22  187.56,47.86 270 bottom
D23  206.87,47.86 270 bottom
D24  225.66,47.86 270 bottom
D25  16.11,28.81 270 bottom
D26  30.08,22.97 180 bottom
D27  54.21,28.81 270 bottom
D28  73.26,28.81 270 bottom
D29  92.31,28.81 270 bottom
D30  111.36,28.81 270 bottom
D31  130.41,28.81 270 bottom
D32  149.45,28.85 270 bottom
D33  168.51,28.81 270 bottom
D34  187.56,28.81 270 bottom
D35  206.61,28.81 270 bottom
D36  225.66,28.81 270 bottom
D37  16.11,9.76 270 bottom
D38  35.16,9.76 270 bottom
D39  54.2,9.76 270 bottom
D40  73.25,9.76 270 bottom
D41  92.31,9.76 270 bottom
D42  120.89,9.76 270 bottom
D43  149.46,9.76 270 bottom
D44  168.51,9.76 270 bottom
D45  187.56,9.76 270 bottom
D46  206.61,9.76 270 bottom
D47  225.66,9.76 270 bottom
G1  50.66,38.46 0 bottom
J1  37.58,73.37 180 bottom
R1  43.8,74.28 0 bottom
R2  31.35,74.28 180 bottom
R3  38.21,66.15 270 bottom
R4  36.94,66.15 270 bottom
R5  43.04,39.46 90 bottom
R6  30.84,36.43 0 bottom
S1  9,66.15 180 top
S2  28.05,66.15 180 top
S3  47.1,66.15 180 top
S4  66.15,66.15 180 top
S5  85.2,66.15 180 top
S6  104.25,66.15 180 top
S7  123.3,66.15 180 top
S8  142.35,66.15 180 top
S9  161.4,66.15 180 top
S10  180.45,66.15 180 top
S11  199.5,66.15 180 top
S12  218.55,66.15 180 top
S13  9,47.1 180 top
S14  28.05,47.1 180 top
S15  47.1,47.1 180 top
S16  66.15,47.1 180 top
S17  85.2,47.1 180 top
S18  104.25,47.1 180 top
S19  123.3,47.1 180 top
S20  142.35,47.1 180 top
S21  161.4,47.1 180 top
S22  180.45,47.1 180 top
S23  199.5,47.1 180 top
S24  218.55,47.1 180 top
S25  9,28.05 180 top
S26  28.05,28.05 180 top
S27  47.1,28.05 180 top
S28  66.15,28.05 180 top
S29  85.2,28.05 180 top
S30  104.25,28.05 180 top
S31  123.3,28.05 180 top
S32  142.35,28.05 180 top
S33  161.4,28.05 180 top
S34  180.45,28.05 180 top
S35  199.5,28.05 180 top
S36  218.55,28.05 180 top
S37  9,9 180 top
S38  28.05,9 180 top
S39  47.1,9 180 top
S40  66.15,9 180 top
S41  85.2,9 180 top
S42  113.78,9 180 top
S43  142.35,9 180 top
S44  161.4,9 180 top
S45  180.45,9 180 top
S46  199.5,9 180 top
S47  218.55,9 180 top
S48  45.83,37.7 270 bottom
U1  37.58,37.58 180 bottom
U2  209.02,37.58 0 top
U3  170.92,18.52 0 top
U4  170.92,56.62 0 top
U5  113.78,37.58 0 top
U6  56.62,18.52 0 top
U7  56.62,56.62 0 top
U8  18.52,37.58 0 top
U$1  76.82,57.51 270 bottom

### Tracks (layer width: path | path; a pad name or v marks a point on that pad's centre or on a via)
+5V  (via drill 0.35)
  Bottom 0.3: U1.P$34 33.3,35.08 | C52.P$1 33.12,34.9 33.3,35.08 | 33.3,35.08 32.53,35.08 v32.16,34.69 | U1.P$24 39.58,33.03 | 39.58,33.03 39.73,32.88 C51.P$1 | 39.58,33.03 39.58,32.53 v39.99,32.11 | U1.P$44 33.38,40.08 | 33.38,40.08 32.7,40.08 C53.P$1 | U1.P$2 35.58,41.87 35.42,42.03 | 35.42,42.03 C54.P$1 | U1.P$7 38.08,42.41 v37.96,42.53 | v33.38,40.75 33.38,40.08 | v34.65,42.78 34.66,42.78 35.42,42.03 | U1.P$14 42.99,39.08 R5.P$1 43.77,39.03 v43.92,39.19 | C27.P$2 42.53,32.37 42.27,32.11 v41.77,32.11
  Bottom 0.55: C1.P$2 4.94,71.99 | 4.94,71.99 5.99,71.99 CR1.P$1 | 4.94,71.99 v4.94,73.14 | 25.05,71.99 CR2.P$1 25.04,71.99 23.73,71.99 | C3.P$2 42.82,73.26 | CR3.P$1 42.82,73.26 | 42.82,73.26 v41.77,73.26 | C4.P$2 62.09,71.99 | 62.09,71.99 63.14,71.99 | v62.09,73.14 62.09,71.99 | C5.P$2 81.39,71.99 | 81.39,71.99 82.19,71.99 CR5.P$1 | 81.39,71.99 81.14,72.25 v81.14,73.14 | C6.P$2 100.19,71.99 | 100.19,71.99 101.24,71.99 CR6.P$1 | 100.19,71.99 v100.19,73.14 | 119.24,71.99 120.29,71.99 CR7.P$1 | 119.24,71.99 C7.P$2 | 119.24,71.99 v119.24,73.14 | C8.P$2 138.29,71.99 | 138.29,71.99 139.35,71.99 CR8.P$1 | 138.29,71.99 v138.29,73.14 | C9.P$2 157.34,71.99 | 157.34,71.99 158.4,71.99 CR9.P$1 | 157.34,71.99 v157.34,73.14 | C10.P$2 176.39,71.98 | 176.39,71.98 CR10.P$1 | 176.39,71.98 v176.39,73.14 | C11.P$2 195.44,71.99 | 195.44,71.99 196.5,71.99 CR11.P$1 | 195.44,71.99 v195.44,73.14 | C12.P$2 214.49,71.99 | 214.49,71.99 215.55,71.99 CR12.P$1 | 214.49,71.99 v214.49,73.14 | C23.P$1 203.56,51.42 | 203.56,51.42 202.5,51.42 CR23.P$1 | 203.56,51.42 v203.56,50.4 | C22.P$1 184.51,51.42 | 184.51,51.42 183.45,51.42 CR22.P$1 | 184.51,51.42 v184.51,50.4 | C21.P$1 165.46,51.42 | 165.46,51.42 164.4,51.42 CR21.P$1 | 165.46,51.42 v165.46,50.4 | 146.41,51.42 v146.41,50.4 | C20.P$1 146.41,51.42 | 146.41,51.43 146.41,51.42 | 146.41,51.42 145.35,51.42 CR20.P$1 | C19.P$1 127.36,51.42 | 127.36,51.42 126.3,51.42 CR19.P$1 | 127.36,51.42 v127.36,50.4 | C18.P$1 108.31,51.42 | 108.31,51.42 107.25,51.42 CR18.P$1 | 108.31,51.42 v108.31,50.4 | C17.P$1 89.26,51.42 | 89.26,51.42 88.2,51.42 CR17.P$1 | 89.26,51.42 v89.26,50.4 | C16.P$1 70.21,51.42 | 70.21,51.42 69.15,51.42 CR16.P$1 | 70.21,51.42 v70.21,50.4
  Bottom 0.55: C15.P$1 51.16,51.42 | 51.16,51.42 50.1,51.42 CR15.P$1 | 51.16,51.42 v51.16,50.4 | C14.P$1 31.05,51.42 CR14.P$1 32.11,51.43 v32.11,50.4 | C13.P$1 13.06,51.42 | 13.06,51.42 12,51.42 CR13.P$1 | 13.06,51.42 v13.06,50.4 | C25.P$2 4.94,33.89 | 4.94,33.89 6,33.89 CR25.P$1 | C26.P$2 23.99,33.88 | 23.99,33.88 CR26.P$1 | 23.99,33.88 v23.99,35.03 | C27.P$2 42.87,33.6 43.16,33.89 43.17,33.88 CR27.P$1 | C28.P$2 62.09,33.89 | 62.09,33.89 63.14,33.89 CR28.P$1 | 62.09,33.89 v62.09,35.03 | 4.94,33.89 v4.94,35.03 | C29.P$2 81.14,33.89 | 81.14,33.89 82.2,33.89 CR29.P$1 | 81.14,33.89 v81.14,35.03 | C30.P$2 100.19,33.89 | 100.19,33.89 101.25,33.89 CR30.P$1 | 100.19,33.89 v100.19,35.03 | C31.P$2 119.24,33.89 | 119.24,33.89 120.3,33.89 CR31.P$1 | 119.24,33.89 v119.24,35.03 | C32.P$2 138.29,33.88 | 138.29,33.88 CR32.P$1 | 138.29,33.88 v138.29,35.03 | C33.P$2 157.34,33.89 | 157.34,33.89 158.4,33.89 CR33.P$1 | 157.34,33.89 v157.34,35.03 | C34.P$2 176.39,33.88 | 176.39,33.88 CR34.P$1 | 176.39,33.88 v176.39,35.03 | C35.P$2 195.44,33.88 | 195.44,33.88 CR35.P$1 | 195.44,33.88 v195.44,35.03 | C36.P$2 214.49,33.89 | 214.49,33.89 215.55,33.89 CR36.P$1 | 214.49,33.89 v214.49,35.03 | C47.P$1 222.61,13.32 | 222.61,13.32 221.55,13.32 CR47.P$1 | 222.61,13.32 v222.61,12.3 | C45.P$1 184.51,13.32 | 184.51,13.32 183.45,13.32 CR45.P$1 | 184.51,13.32 v184.51,12.3 | C44.P$1 165.46,13.32 | 165.46,13.32 164.4,13.32 CR44.P$1 | 165.46,13.32 v165.46,12.3 | C43.P$1 146.41,13.32 | 146.41,13.32 145.35,13.32 CR43.P$1 | 146.41,13.32 v146.41,12.3 | C42.P$1 117.97,13.32 | 117.97,13.32 116.78,13.32 CR42.P$1 | 117.97,13.32 v117.97,12.3 | C41.P$1 89.26,13.31 | 89.26,13.31 88.2,13.31 CR41.P$1 | 89.26,13.31 v89.26,12.3
  Bottom 0.55: C40.P$1 70.94,13.33 70.21,13.33 | 70.21,13.33 CR40.P$1 | 70.21,13.33 v70.21,12.3 | C38.P$1 32.11,13.31 | 32.11,13.31 31.05,13.31 CR38.P$1 | 32.11,13.31 v32.11,12.3 | C37.P$1 13.06,13.31 | 13.06,13.31 12,13.31 CR37.P$1 | 13.06,13.31 v13.06,12.3 | C2.P$2 23.73,71.99 | v23.73,73.14 23.73,71.99 | C24.P$1 222.61,51.42 | 222.61,51.42 221.56,51.42 CR24.P$1 | v222.61,50.4 222.61,51.42 | C46.P$1 203.56,13.32 | 203.56,13.32 202.51,13.32 CR46.P$1 | v203.56,12.3 203.56,13.32 | C39.P$1 51.16,13.31 | 51.16,13.31 50.12,13.31 CR39.P$1 | v51.16,12.3 51.16,13.31
  Bottom 0.6: 63.14,71.99 CR4.P$1 | U$1.P$1 76,61.01 v76.31,61.32 | J1.A4B9 35.17,70.22 35.16,70.21 35.67,69.71 v36.05,69.71 | J1.B4A9 39.97,70.22 39.46,69.71 v39.1,69.71
  pour Route2 (isolate 0.7, rank 2, no thermals): -7.51,-9.03 -7.51,79.36 232.77,79.36 232.77,-9.03
BL-CS  (via drill 0.35)
  Top 0.152: v77.83,19.72 77.83,33.13 77.33,33.64 77.33,34.15 78.34,35.16 78.34,56.37 v77.71,57.01
  Bottom 0.152: U1.P$28 37.58,21.57 39.23,19.92 47.35,19.92 47.86,20.43 54.47,20.43 55.09,21.05 58.16,21.05 59.5,19.72 v77.83,19.72 | U$1.P$5 v77.71,57.01
BL-IRQ  (via drill 0.35)
  Top 0.152: v34.15,41.77 31.86,41.77 30.37,43.25 30.37,58.82 34.65,63.1 48.37,63.1 49.39,62.09 61.07,62.09 62.09,63.1 65.13,63.1 v70.21,58.02
  Bottom 0.152: v70.21,58.02 74.87,58.02 U$1.P$4
  Bottom 0.3: U1.P$1 34.38,41.77 v34.15,41.77
BL-RST  (via drill 0.35)
  Top 0.152: v79.61,21.52 79.61,26.27 78.85,27.03 78.85,28.81 79.61,29.57 79.61,45.58 78.85,46.34 78.85,47.73 79.87,48.75 79.87,58.53 v79.48,58.91
  Bottom 0.152: U1.P$25 39.08,22.87 40.5,21.45 45.83,21.45 46.34,21.95 53.07,21.95 53.58,22.46 58.78,22.46 59.72,21.52 v79.61,21.52 | U$1.P$3 79.38,59.01 v79.48,58.91
COL_1
  Top 0.3: S1.P$2 S13.P$2 S25.P$2 S37.P$2
  Bottom 0.152: U1.P$40 22.34,38.08 19.92,40.5 17,40.5 14.58,38.08 7.73,38.08 6.46,39.34 S13.P$2
COL_2
  Top 0.3: S38.P$2 S26.P$2 S14.P$2 S2.P$2
  Bottom 0.152: S26.P$2 25.51,21.95 26.53,20.94 34.15,20.94 35.08,21.87 U1.P$33
COL_3
  Top 0.3: S3.P$2 S15.P$2 44.56,39.99 44.81,39.73 44.81,34.15 44.56,33.89 S27.P$2 S39.P$2
  Bottom 0.152: U1.P$12 41.85,40.08 43.8,42.02 S15.P$2
COL_4
  Top 0.3: S4.P$2 S16.P$2 S28.P$2 S40.P$2
  Bottom 0.152: U1.P$8 38.58,42.14 38.67,42.23 38.67,58.73 43.04,63.1 46.34,63.1 48.37,61.07 S4.P$2
COL_5
  Top 0.3: S41.P$2 S29.P$2 S17.P$2 S5.P$2
  Bottom 0.152: S17.P$2 82.66,39.12 79.72,36.18 47.86,36.18 46.97,37.08 U1.P$18
COL_6
  Top 0.3: S6.P$2 S18.P$2 S30.P$2
  Bottom 0.152: S18.P$2 101.71,38.72 98.79,35.8 47.73,35.8 46.96,36.58 U1.P$19
COL_7
  Top 0.3: S42.P$2 111.23,16.24 113.39,18.4 116.19,18.4 S31.P$2 S19.P$2 S7.P$2
  Bottom 0.152: U1.P$26 38.58,22.46 40.1,20.94 46.34,20.94 46.85,21.45 53.45,21.45 53.96,21.95 58.66,21.95 59.8,20.81 118.6,20.81 S31.P$2
COL_8
  Top 0.3: S8.P$2 S20.P$2 S32.P$2 S43.P$2
  Bottom 0.152: U1.P$27 38.08,22.09 39.73,20.43 46.85,20.43 47.35,20.94 53.96,20.94 54.47,21.45 58.53,21.45 59.55,20.43 137.27,20.43 S32.P$2
COL_9
  Top 0.3: S44.P$2 S33.P$2 S21.P$2 S9.P$2
  Bottom 0.152: S33.P$2 158.86,21.45 157.46,20.05 79.36,20.05 76.18,16.87 59.04,16.87 57.89,15.73 55.36,15.73 53.96,17.13 38.21,17.13 37.08,18.26 U1.P$29
COL_10
  Top 0.3: S10.P$2 S22.P$2 S34.P$2 S45.P$2
  Bottom 0.152: U1.P$30 36.58,17.87 37.83,16.62 53.7,16.62 55.23,15.1 58.02,15.1 59.42,16.49 76.44,16.49 79.61,19.67 165.97,19.67 169.27,22.97 S34.P$2
COL_11
  Top 0.3: S46.P$2 S35.P$2 S23.P$2 S11.P$2
  Bottom 0.152: S35.P$2 196.96,17.25 195.82,16.11 172.83,16.11 172.58,15.86 169.27,15.86 169.02,16.11 128.63,16.11 127.24,14.71 124.44,14.71 123.05,16.11 104.76,16.11 103.36,14.71 100.19,14.71 98.79,16.11 59.8,16.11 58.28,14.59 54.97,14.59 53.45,16.11 37.32,16.11 36.08,17.36 U1.P$31
COL_12  (via drill 0.35)
  Top 0.152: v38.21,14.04 v38.21,10.75
  Top 0.3: S12.P$2 S24.P$2 S36.P$2 S47.P$2
  Bottom 0.152: v38.21,14.04 35.58,16.68 U1.P$32 | v38.21,10.75 38.21,2.14 39.23,1.13 97.14,1.13 100.19,4.17 103.36,4.17 106.41,1.13 121.39,1.13 124.44,4.17 127.11,4.17 130.16,1.13 214.99,1.13 216.01,2.14 S47.P$2
D+
  Bottom 0.152: R3.P$1 38.21,68.69 38.34,68.82 38.34,70.71 38.33,70.72
  Bottom 0.3: J1.A6 37.33,70.29 37.53,70.08 38.12,70.08 38.33,70.29 38.33,70.72 J1.B6
D-
  Bottom 0.152: J1.B7 36.83,68.81 36.94,68.69 R4.P$1
  Bottom 0.3: J1.B7 36.83,71.73 37.03,71.93 37.62,71.93 37.83,71.73 J1.A7
GND  (via drill 0.35)
  Bottom 0.3: U1.P$23 40.08,34.65 40.08,35.08 U1.P$45 | C27.P$1 43.58,34.69 v43.8,34.91 44.41,35.52 S48.P$2 | C51.P$2 41.26,33.04 v41.26,33.64 | C52.P$2 33.63,33.12 v34.15,33.64 | C53.P$2 v30.72,40.11 | C54.P$2 v35.42,45.07 | C48.P$1 37.19,44.05 v37.83,44.69 | CR26.P$4 31.05,31.91 v31.61,31.35 | C50.P$2 48,38.29 v46.92,38.29 | G1.P$2 49.81,37.61 v50.66,38.46 51.51,39.31 G1.P$4 | C49.P$1 53.29,40.53 v53.2,40.62 | U1.P$35 35.58,35.58 v35.8,35.8 U1.P$45 | U1.P$43 35.58,39.58 v35.8,39.35 U1.P$45 | U1.P$5 37.08,39.85 v37.58,39.35 U1.P$45 | U1.P$15 38.58,38.58 U1.P$45 | U1.P$45 v37.58,35.8 | U1.P$45 v39.35,35.8 | U1.P$45 v39.35,37.58 | U1.P$45 v39.35,39.35 | U1.P$45 v35.8,37.58
  Bottom 0.55: C1.P$1 v2.14,71.99 | CR1.P$4 v13.57,70.48 v13.57,70.47 | C2.P$1 v21.19,71.99 | CR2.P$4 32.15,70.48 J1.SHIELD | C3.P$1 45.23,73.9 | 45.23,73.9 v46.08,73.9 | R1.P$1 44.61,73.9 45.23,73.9 | CR3.P$4 v51.66,70.48 v51.67,70.47 | C4.P$1 v59.29,71.99 | CR4.P$4 v70.71,70.48 v70.72,70.47 | C5.P$1 v78.34,71.99 | CR5.P$4 v89.76,70.48 v89.77,70.47 | C6.P$1 v97.39,71.99 | CR6.P$4 v108.81,70.48 v108.82,70.47 | C7.P$1 v116.44,71.99 | CR7.P$4 v127.87,70.48 v127.87,70.47 | C8.P$1 v135.49,71.99 | CR8.P$4 v146.92,70.48 v146.92,70.47 | C9.P$1 v154.54,71.99 | CR9.P$4 v165.97,70.48 v165.97,70.47 | C10.P$1 v173.59,71.99 | CR10.P$4 v185.02,70.48 v185.02,70.47 | C11.P$1 v192.64,71.99 | CR11.P$4 v204.07,70.48 v204.07,70.47 | C12.P$1 v211.69,71.99 | CR12.P$4 v223.12,70.48 v223.12,70.47 | C24.P$2 v225.41,51.42 | CR24.P$4 v213.98,52.93 v213.98,52.94 | C23.P$2 v206.36,51.42 | CR23.P$4 v194.93,52.93 v194.93,52.94 | C22.P$2 v187.44,51.42 | CR22.P$4 v175.88,52.93 v175.88,52.94 | C21.P$2 v168.26,51.42 | CR21.P$4 v156.83,52.93 v156.83,52.94 | C20.P$2 v149.21,51.42 | C19.P$2 v130.16,51.42 | CR19.P$4 v118.73,52.93 v118.73,52.94 | CR20.P$4 139.35,52.94 v137.78,52.94 | C18.P$2 v111.23,51.42 | CR18.P$4 v99.68,52.93 v99.68,52.94 | C17.P$2 v92.06,51.42 | CR17.P$4 v80.63,52.93 v80.63,52.94 | C16.P$2 v73.14,51.42 | CR16.P$4 v61.58,52.93 v61.58,52.94 | C15.P$2 v54.09,51.42 | CR15.P$4 44.1,52.94 v42.53,52.94 | C14.P$2 v35.03,51.42 | CR14.P$4 v23.48,52.93 v23.48,52.94 | C13.P$2 v15.86,51.42 | CR13.P$4 v4.43,52.93 v4.43,52.94 | CR25.P$4 v13.57,32.38 v13.57,32.37 | C26.P$1 v21.19,33.89 | CR27.P$4 v51.66,32.38 v51.67,32.37 | C28.P$1 v59.29,33.89 | CR28.P$4 v70.71,32.38 v70.72,32.37 | C29.P$1 v78.34,33.89
  Bottom 0.55: CR29.P$4 v89.77,32.38 v89.77,32.37 | C30.P$1 v97.27,33.89 | CR30.P$4 v108.82,32.38 v108.82,32.37 | C31.P$1 v116.44,33.89 | CR31.P$4 v127.87,32.38 v127.87,32.37 | C32.P$1 v135.49,33.89 | CR32.P$4 v146.92,32.38 v146.92,32.37 | C33.P$1 v154.54,33.89 | CR33.P$4 v165.97,32.38 v165.97,32.37 | C34.P$1 v173.59,33.89 | CR34.P$4 v185.02,32.38 v185.02,32.37 | C35.P$1 v192.64,33.89 | CR35.P$4 v204.07,32.38 v204.07,32.37 | C36.P$1 v211.69,33.89 | CR36.P$4 v223.12,32.38 v223.12,32.37 | C47.P$2 v225.53,13.32 | CR47.P$4 v213.98,14.83 v213.98,14.84 | C46.P$2 v206.48,13.32 | CR46.P$4 v194.93,14.83 v194.93,14.84 | C45.P$2 v187.44,13.32 | CR45.P$4 v175.88,14.83 v175.88,14.84 | C44.P$2 v168.38,13.32 | CR44.P$4 v156.83,14.83 v156.83,14.84 | C43.P$2 v149.33,13.32 | CR43.P$4 v137.78,14.83 v137.78,14.84 | C42.P$2 v120.76,13.32 | CR42.P$4 v109.08,14.83 v109.08,14.84 | C41.P$2 v92.19,13.32 | CR41.P$4 v80.63,14.83 v80.63,14.84 | C40.P$2 v73.14,13.31 v73.14,13.32 | CR40.P$4 v61.58,14.83 v61.58,14.84 | C39.P$2 v54.09,13.31 v54.09,13.32 | CR39.P$4 v42.53,14.83 v42.53,14.84 | C38.P$2 v35.03,13.32 | CR38.P$4 v23.48,14.83 v23.48,14.84 | C37.P$2 v15.98,13.31 v15.98,13.32 | CR37.P$4 v4.43,14.83 v4.43,14.84
  Bottom 0.6: R2.P$1 30.92,73.44 v31.1,73.26 | J1.B1A12 41.32,71.01 J1.SHIELD1 | J1.A1B12 33.83,71.01 J1.SHIELD | C25.P$1 3.16,33.86 v3.16,32.88 | U$1.P$2 76.32,60.01 v76.53,60.22
  other vias: 37.58,37.58
  pour Route15 (isolate 0.7, no thermals): -4.46,-1.41 -4.46,81.9 231.76,81.9 231.76,-1.41
  pour Top (isolate 0.7, no thermals): -18.69,-2.43 -18.69,78.09 230.49,78.09 230.49,-2.43
  pour Route2: 34.65,34.65 34.65,40.5 40.5,40.5 40.5,34.65
MISO  (via drill 0.35)
  Top 0.152: v76.06,37.19 76.18,37.32 v76.18,54.97
  Bottom 0.152: U1.P$11 40.08,42.11 41.39,43.42 45.7,43.42 47.73,41.39 55.36,41.39 59.55,37.19 v76.06,37.19
  Bottom 0.3: U$1.P$7 76.14,55.01 v76.18,54.97
MOSI  (via drill 0.35)
  Top 0.152: v76.95,55.74 v76.95,37.96
  Bottom 0.152: U1.P$10 39.58,42.37 41,43.8 45.83,43.8 47.86,41.77 55.74,41.77 59.55,37.96 v76.95,37.96 | U$1.P$6 76.67,56.01 v76.95,55.74
N$1
  Bottom 0.152: CR24.P$2 225.9,52.93 226.93,53.96 226.93,71.1 226.04,71.99 221.56,71.99 CR12.P$3
N$2  (via drill 0.35)
  Top 0.152: v3.67,31.61 2.65,31.61 1.13,33.13 1.13,49.89 2.65,51.42 v4.17,51.42
  Bottom 0.152: CR25.P$2 4.44,32.38 v3.67,31.61 | v4.17,51.42 4.19,51.43 CR13.P$3
N$3
  Bottom 0.152: U1.P$4 36.58,44.45 38.21,46.08 R3.P$2
N$4
  Bottom 0.3: J1.B5 39.33,73.74 39.86,74.28 R1.P$2
N$5
  Bottom 0.152: D1.P$2 14.51,63.61 S1.P$1
N$6
  Bottom 0.3: J1.A5 36.33,73.75 35.8,74.28 R2.P$2
N$7
  Bottom 0.152: U1.P$3 36.08,44.66 37.7,46.28 37.7,64.95 R4.P$2
N$8
  Bottom 0.152: U1.P$13 41.15,39.65 41.84,39.65 42.09,39.9 R5.P$2 S48.P$1
N$9
  Bottom 0.152: CR2.P$2 21.2,70.48 21.19,70.47 19.68,71.98 CR1.P$3
N$10
  Bottom 0.152: D2.P$2 33.56,63.61 S2.P$1
N$11
  Bottom 0.152: U1.P$6 37.58,41.9 37.25,42.23 37.25,42.69 C48.P$2
N$12
  Bottom 0.152: U1.P$17 46.97,37.58 47.86,36.69 50.83,36.69 G1.P$1 52.69,38.55 C49.P$2
N$13  (via drill 0.35)
  Top 0.152: v42.78,69.71 41.51,69.71 38.21,73.01 v32.37,73.01
  Bottom 0.152: CR3.P$2 43.05,70.48 42.78,70.21 v42.78,69.71 | CR2.P$3 31.06,71.99 32.11,71.99 32.37,72.25 v32.37,73.01
N$14
  Bottom 0.152: S13.P$1 14.51,44.56 D13.P$2
N$16
  Bottom 0.152: U1.P$37 32.38,36.58 32.24,36.43 R6.P$1
N$17
  Bottom 0.152: CR13.P$2 15.87,52.93 17.37,51.43 CR14.P$3
N$18
  Bottom 0.152: G1.P$3 49.46,39.41 C50.P$1 47.04,39.41 45.7,38.08 U1.P$16
N$19
  Bottom 0.152: S20.P$1 147.86,44.56 D20.P$2
N$20
  Bottom 0.152: D3.P$2 52.61,63.61 S3.P$1
N$23
  Bottom 0.152: CR4.P$2 59.28,70.48 57.78,71.98 CR3.P$3
N$27
  Bottom 0.152: CR19.P$2 130.17,52.93 131.67,51.43 CR20.P$3
N$28
  Bottom 0.152: S14.P$1 33.56,44.56 D14.P$2
N$30
  Bottom 0.152: D4.P$2 71.66,63.61 S4.P$1
N$33
  Bottom 0.152: CR4.P$3 77.08,71.98 78.58,70.48 CR5.P$2
N$35  (via drill 0.35)
  Top 0.152: v36.99,51.42 v39.38,51.42
  Bottom 0.152: CR14.P$2 34.67,52.93 36.18,51.42 v36.99,51.42 | v39.38,51.42 v39.39,51.43 CR15.P$3
N$40
  Bottom 0.152: D5.P$2 90.71,63.61 S5.P$1
N$43
  Bottom 0.152: CR5.P$3 95.88,71.98 97.38,70.48 CR6.P$2
N$46
  Bottom 0.152: S15.P$1 52.61,44.56 D15.P$2
N$49
  Bottom 0.152: CR15.P$2 53.97,52.93 55.47,51.43 CR16.P$3
N$50
  Bottom 0.152: D6.P$2 109.76,63.61 S6.P$1
N$53
  Bottom 0.152: CR6.P$3 115.18,71.98 116.68,70.48 CR7.P$2
N$55
  Bottom 0.152: S21.P$1 166.91,44.56 D21.P$2
N$59
  Bottom 0.152: CR20.P$2 149.22,52.93 150.72,51.43 CR21.P$3
N$60
  Bottom 0.152: D7.P$2 128.81,63.61 S7.P$1
N$63
  Bottom 0.152: CR7.P$3 133.98,71.98 135.48,70.48 CR8.P$2
N$64
  Bottom 0.152: S16.P$1 71.66,44.56 D16.P$2
N$65
  Bottom 0.152: CR28.P$2 59.3,32.38 59.29,32.37 57.78,33.88 CR27.P$3
N$67
  Bottom 0.152: CR16.P$2 73.02,52.93 74.52,51.43 CR17.P$3
N$70
  Bottom 0.152: D8.P$2 147.86,63.61 S8.P$1
N$73
  Bottom 0.152: CR9.P$2 154.78,70.48 153.28,71.98 CR8.P$3
N$78
  Bottom 0.152: S17.P$1 90.71,44.56 D17.P$2
N$80
  Bottom 0.152: D9.P$2 166.91,63.61 S9.P$1
N$83
  Bottom 0.152: CR9.P$3 172.08,71.98 173.58,70.48 CR10.P$2
N$85
  Bottom 0.152: CR17.P$2 91.82,52.93 93.32,51.43 CR18.P$3
N$87
  Bottom 0.152: S22.P$1 185.96,44.56 D22.P$2
N$90
  Bottom 0.152: D10.P$2 185.96,63.61 S10.P$1
N$93
  Bottom 0.152: CR10.P$3 191.38,71.98 192.88,70.48 CR11.P$2
N$95
  Bottom 0.152: CR21.P$2 168.27,52.93 169.77,51.43 CR22.P$3
N$96
  Bottom 0.152: S18.P$1 109.76,44.56 D18.P$2
N$100
  Bottom 0.152: D11.P$2 205.01,63.61 S11.P$1
N$103
  Bottom 0.152: CR12.P$2 211.68,70.48 210.18,71.98 CR11.P$3
N$110
  Bottom 0.152: D12.P$2 224.19,63.61 S12.P$1
N$114
  Bottom 0.152: S19.P$1 128.81,44.56 D19.P$2
N$118
  Bottom 0.152: CR18.P$2 111.12,52.93 112.62,51.43 CR19.P$3
N$119
  Bottom 0.152: S23.P$1 205.26,44.56 D23.P$2
N$123
  Bottom 0.152: CR22.P$2 187.32,52.93 188.82,51.43 CR23.P$3
N$129
  Bottom 0.152: S24.P$1 224.06,44.56 D24.P$2
N$133
  Bottom 0.152: CR23.P$2 206.37,52.93 207.87,51.43 CR24.P$3
N$139
  Bottom 0.152: S25.P$1 14.51,25.51 D25.P$2
N$142
  Bottom 0.152: CR26.P$2 15.85,32.38 14.35,33.88 CR25.P$3
N$149
  Bottom 0.152: S26.P$1 31.86,23.05 D26.P$2
N$152  (via drill 0.35)
  Top 0.152: v40.75,31.3 37.5,31.3 37.35,31.45 v34.36,31.45
  Bottom 0.152: CR26.P$3 32.13,33.88 32.37,33.64 32.37,31.99 32.9,31.45 v34.36,31.45 | v40.75,31.3 41.97,31.3 43.05,32.38 CR27.P$2
N$159
  Bottom 0.152: S27.P$1 52.61,25.51 D27.P$2
N$169
  Bottom 0.152: S28.P$1 71.66,25.51 D28.P$2
N$172
  Bottom 0.152: CR29.P$2 78.33,32.38 76.83,33.88 CR28.P$3
N$179
  Bottom 0.152: S29.P$1 90.71,25.51 D29.P$2
N$182
  Bottom 0.152: CR30.P$2 97.38,32.38 95.88,33.88 CR29.P$3
N$189
  Bottom 0.152: S30.P$1 109.76,25.51 D30.P$2
N$192
  Bottom 0.152: CR31.P$2 116.43,32.38 114.93,33.88 CR30.P$3
N$199
  Bottom 0.152: S31.P$1 128.81,25.51 D31.P$2
N$202
  Bottom 0.152: CR32.P$2 135.73,32.38 134.23,33.88 CR31.P$3
N$209
  Bottom 0.152: S32.P$1 147.82,25.51 D32.P$2
N$212
  Bottom 0.152: CR33.P$2 154.78,32.38 153.28,33.88 CR32.P$3
N$219
  Bottom 0.152: S33.P$1 166.91,25.51 D33.P$2
N$222
  Bottom 0.152: CR34.P$2 173.83,32.38 172.33,33.88 CR33.P$3
N$229
  Bottom 0.152: S34.P$1 185.96,25.51 D34.P$2
N$232
  Bottom 0.152: CR35.P$2 192.88,32.38 191.38,33.88 CR34.P$3
N$239
  Bottom 0.152: S35.P$1 205.01,25.51 D35.P$2
N$242
  Bottom 0.152: CR36.P$2 211.93,32.38 210.43,33.88 CR35.P$3
N$249
  Bottom 0.152: S36.P$1 224.06,25.51 D36.P$2
N$252
  Bottom 0.152: CR47.P$2 225.9,14.83 226.93,15.86 226.93,32.88 225.92,33.89 221.56,33.89 CR36.P$3
N$259
  Bottom 0.152: S37.P$1 14.51,6.46 D37.P$2
N$269
  Bottom 0.152: S38.P$1 33.56,6.46 D38.P$2
N$273
  Bottom 0.152: CR37.P$2 15.87,14.83 17.37,13.33 CR38.P$3
N$279
  Bottom 0.152: S39.P$1 52.6,6.46 D39.P$2
N$283
  Bottom 0.152: CR38.P$2 34.92,14.83 36.42,13.33 CR39.P$3
N$289
  Bottom 0.152: S40.P$1 71.65,6.46 D40.P$2
N$293
  Bottom 0.152: CR39.P$2 53.72,14.83 55.22,13.33 CR40.P$3
N$299
  Bottom 0.152: S41.P$1 90.71,6.46 D41.P$2
N$303
  Bottom 0.152: CR40.P$2 73.02,14.83 74.52,13.33 CR41.P$3
N$309
  Bottom 0.152: S42.P$1 119.29,6.46 D42.P$2
N$313
  Bottom 0.152: CR41.P$2 91.82,14.83 93.32,13.33 CR42.P$3
N$319
  Bottom 0.152: S43.P$1 147.86,6.46 D43.P$2
N$323
  Bottom 0.152: CR42.P$2 120.52,14.83 122.02,13.33 CR43.P$3
N$329
  Bottom 0.152: S44.P$1 166.91,6.46 D44.P$2
N$333
  Bottom 0.152: CR43.P$2 149.22,14.83 150.72,13.33 CR44.P$3
N$339
  Bottom 0.152: S45.P$1 185.96,6.46 D45.P$2
N$343
  Bottom 0.152: CR44.P$2 168.27,14.83 169.77,13.33 CR45.P$3
N$349
  Bottom 0.152: S46.P$1 205.01,6.46 D46.P$2
N$353
  Bottom 0.152: CR45.P$2 187.32,14.83 188.82,13.33 CR46.P$3
N$359
  Bottom 0.152: S47.P$1 224.06,6.46 D47.P$2
N$363
  Bottom 0.152: CR46.P$2 206.37,14.83 207.87,13.33 CR47.P$3
RGB
  Bottom 0.152: R6.P$2 29.45,36.43 29.32,36.56 22.08,36.56 19.79,34.27 17.13,34.27 14.84,36.56 2.27,36.56 1.25,35.54 1.25,14.71 2.64,13.33 CR37.P$3
ROW_A  (via drill 0.35)
  Top 0.152: v32.11,68.61 v39.1,68.61
  Bottom 0.152: U1.P$39 22.21,37.58 19.67,40.11 17.38,40.11 14.84,37.58 2.14,37.58 1.13,38.59 1.13,67.67 2.06,68.61 D1.P$1 v32.11,68.61 D2.P$1 | v39.1,68.61 54.11,68.61 | D3.P$1 D4.P$1 D5.P$1 D6.P$1 D7.P$1 D8.P$1 D9.P$1 D10.P$1 D11.P$1 D12.P$1
  Bottom 0.3: D3.P$1 54.16,68.56 54.11,68.61
ROW_B  (via drill 0.35)
  Top 0.152: v36.99,49.56 v39.38,49.56
  Bottom 0.152: D24.P$1 D23.P$1 D22.P$1 D21.P$1 D20.P$1 D19.P$1 D18.P$1 D17.P$1 D16.P$1 D15.P$1 v39.38,49.56 | U1.P$41 22.48,38.58 20.18,40.88 16.75,40.88 14.45,38.58 12.3,38.58 11.41,39.47 11.41,48.49 12.48,49.56 D13.P$1 D14.P$1 v36.99,49.56
ROW_C  (via drill 0.35)
  Top 0.152: v34.36,30.59 v39.79,30.59
  Bottom 0.152: D27.P$1 54.47,30.51 | 54.47,30.51 D28.P$1 D29.P$1 D30.P$1 D31.P$1 130.45,30.55 D32.P$1 168.48,30.55 D33.P$1 D34.P$1 D35.P$1 D36.P$1 | U1.P$36 32.62,36.08 32.22,35.67 29.32,35.67 28.92,36.08 22.23,36.08 19.92,33.77 16.9,33.77 14.59,36.08 2.67,36.08 1.76,35.16 1.76,31.48 2.73,30.51 D25.P$1 16.19,30.59 31.1,30.59 | 31.1,30.59 v34.36,30.59 | v39.79,30.59 54.39,30.59 54.47,30.51 | D26.P$1 28.38,24.83 31.1,27.54 31.1,30.59
ROW_D
  Bottom 0.152: D47.P$1 D46.P$1 D45.P$1 D44.P$1 D43.P$1 D42.P$1 D41.P$1 D40.P$1 D39.P$1 D38.P$1 D37.P$1 2.09,11.46 0.74,12.81 0.74,35.93 1.89,37.08 15.21,37.08 17.51,34.78 19.53,34.78 21.83,37.08 U1.P$38
SCK  (via drill 0.35)
  Top 0.152: v72.25,53.83 72.25,48.37 72.75,47.86 72.75,46.34 72.25,45.83 v72.25,38.67
  Bottom 0.152: U1.P$9 39.08,42.5 40.75,44.18 45.96,44.18 47.99,42.15 56.24,42.15 59.72,38.67 v72.25,38.67 | U$1.P$8 72.43,54.01 v72.25,53.83

### Text on the board
bPlace: JLCJLCJLCJLC | 5V | GND | PD4 / RST | PE6 / IRQ | PB4 / CS | PB2 / MOSI | PB3 / MISO | PB1 / SCK | rev 1.0 | TECLADITOW-40